# EAGLE design line-sensor-var1a-r3 (EAGLE 9.5.1)
Assembly variants: I2C, USART, SPI

## Sheet 1 of 5
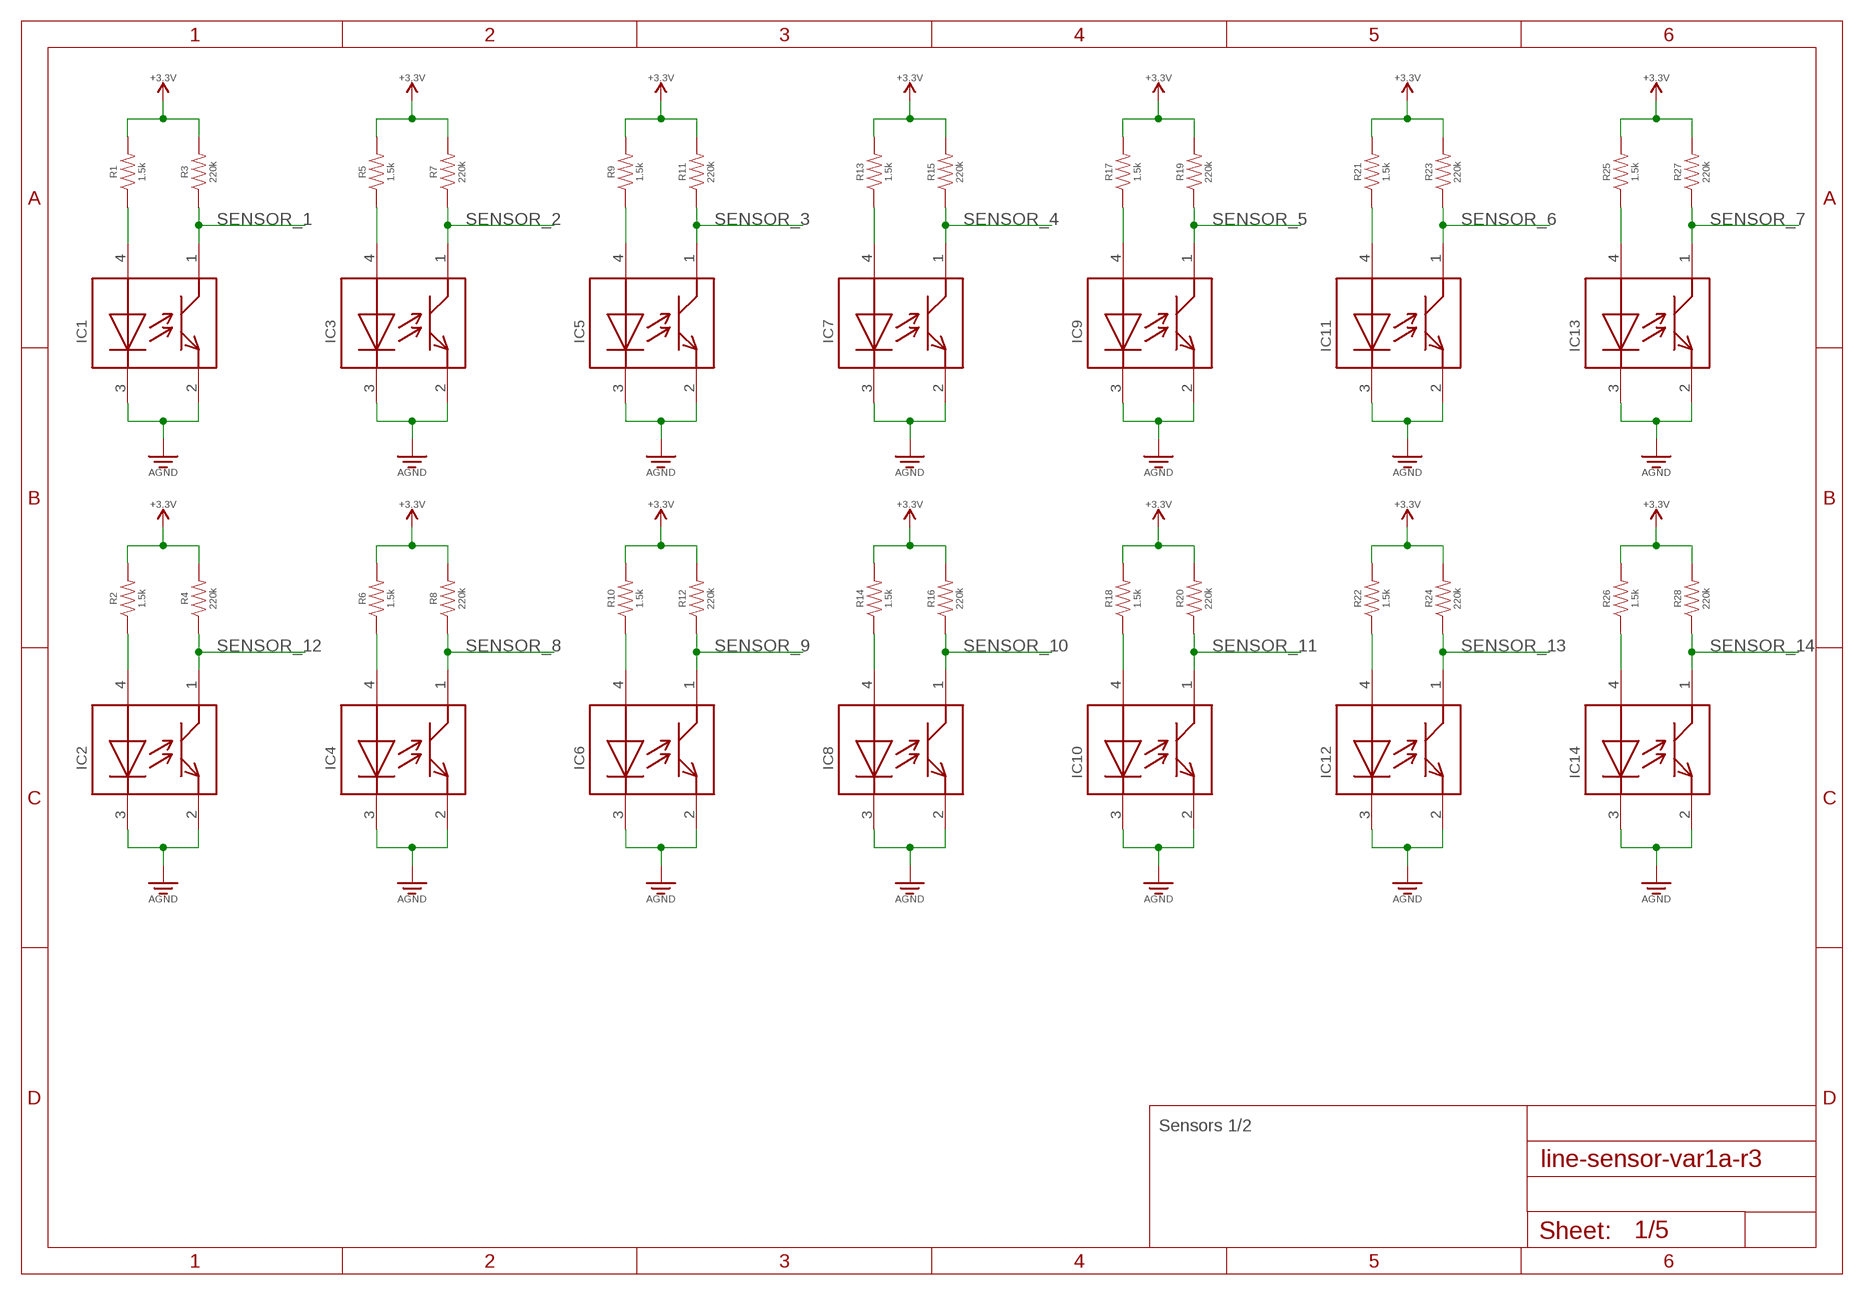
[diagram p0: schematic, sheet 1]

### Parts
IC1  GP2S60  [GP2S60]
IC2  GP2S60  [GP2S60]
IC3  GP2S60  [GP2S60]
IC4  GP2S60  [GP2S60]
IC5  GP2S60  [GP2S60]
IC6  GP2S60  [GP2S60]
IC7  GP2S60  [GP2S60]
IC8  GP2S60  [GP2S60]
IC9  GP2S60  [GP2S60]
IC10  GP2S60  [GP2S60]
IC11  GP2S60  [GP2S60]
IC12  GP2S60  [GP2S60]
IC13  GP2S60  [GP2S60]
IC14  GP2S60  [GP2S60]
R1  1.5k  RESISTOR0603  [RESISTOR-0603]
R2  1.5k  RESISTOR0603  [RESISTOR-0603]
R3  220k  RESISTOR0603  [RESISTOR-0603]
R4  220k  RESISTOR0603  [RESISTOR-0603]
R5  1.5k  RESISTOR0603  [RESISTOR-0603]
R6  1.5k  RESISTOR0603  [RESISTOR-0603]
R7  220k  RESISTOR0603  [RESISTOR-0603]
R8  220k  RESISTOR0603  [RESISTOR-0603]
R9  1.5k  RESISTOR0603  [RESISTOR-0603]
R10  1.5k  RESISTOR0603  [RESISTOR-0603]
R11  220k  RESISTOR0603  [RESISTOR-0603]
R12  220k  RESISTOR0603  [RESISTOR-0603]
R13  1.5k  RESISTOR0603  [RESISTOR-0603]
R14  1.5k  RESISTOR0603  [RESISTOR-0603]
R15  220k  RESISTOR0603  [RESISTOR-0603]
R16  220k  RESISTOR0603  [RESISTOR-0603]
R17  1.5k  RESISTOR0603  [RESISTOR-0603]
R18  1.5k  RESISTOR0603  [RESISTOR-0603]
R19  220k  RESISTOR0603  [RESISTOR-0603]
R20  220k  RESISTOR0603  [RESISTOR-0603]
R21  1.5k  RESISTOR0603  [RESISTOR-0603]
R22  1.5k  RESISTOR0603  [RESISTOR-0603]
R23  220k  RESISTOR0603  [RESISTOR-0603]
R24  220k  RESISTOR0603  [RESISTOR-0603]
R25  1.5k  RESISTOR0603  [RESISTOR-0603]
R26  1.5k  RESISTOR0603  [RESISTOR-0603]
R27  220k  RESISTOR0603  [RESISTOR-0603]
R28  220k  RESISTOR0603  [RESISTOR-0603]
SUPPLY1  +3.3V  (no package)
SUPPLY2  +3.3V  (no package)
SUPPLY3  +3.3V  (no package)
SUPPLY4  +3.3V  (no package)
SUPPLY5  +3.3V  (no package)
SUPPLY6  +3.3V  (no package)
SUPPLY7  +3.3V  (no package)
SUPPLY8  +3.3V  (no package)
SUPPLY9  +3.3V  (no package)
SUPPLY10  +3.3V  (no package)
SUPPLY11  +3.3V  (no package)
SUPPLY12  +3.3V  (no package)
SUPPLY13  +3.3V  (no package)
SUPPLY14  +3.3V  (no package)

### Nets
GND: IC1.2 IC1.3 IC2.2 IC2.3 IC3.2 IC3.3 IC4.2 IC4.3 IC5.2 IC5.3 IC6.2 IC6.3 IC7.2 IC7.3 IC8.2 IC8.3 IC9.2 IC9.3 IC10.2 IC10.3 IC11.2 IC11.3 IC12.2 IC12.3 IC13.2 IC13.3 IC14.2 IC14.3 ; supply symbol labelled AGND ; also sheet 2,3,4
N$1: IC3.4 R5.P$1
N$2: IC1.4 R1.P$1
N$3: IC5.4 R9.P$1
N$4: IC7.4 R13.P$1
N$5: IC9.4 R17.P$1
N$6: IC11.4 R21.P$1
N$7: IC13.4 R25.P$1
N$8: IC4.4 R6.P$1
N$9: IC6.4 R10.P$1
N$10: IC8.4 R14.P$1
N$11: IC10.4 R18.P$1
N$12: IC2.4 R2.P$1
N$13: IC12.4 R22.P$1
N$14: IC14.4 R26.P$1
SENSOR_1: IC1.1 R3.P$1 ; also sheet 3
SENSOR_2: IC3.1 R7.P$1 ; also sheet 3
SENSOR_3: IC5.1 R11.P$1 ; also sheet 3
SENSOR_4: IC7.1 R15.P$1 ; also sheet 3
SENSOR_5: IC9.1 R19.P$1 ; also sheet 3
SENSOR_6: IC11.1 R23.P$1 ; also sheet 3
SENSOR_7: IC13.1 R27.P$1 ; also sheet 3
SENSOR_8: IC4.1 R8.P$1 ; also sheet 3
SENSOR_9: IC6.1 R12.P$1 ; also sheet 3
SENSOR_10: IC8.1 R16.P$1 ; also sheet 3
SENSOR_11: IC10.1 R20.P$1 ; also sheet 3
SENSOR_12: IC2.1 R4.P$1 ; also sheet 3
SENSOR_13: IC12.1 R24.P$1 ; also sheet 3
SENSOR_14: IC14.1 R28.P$1 ; also sheet 3
VDD: R1.P$2 R2.P$2 R3.P$2 R4.P$2 R5.P$2 R6.P$2 R7.P$2 R8.P$2 R9.P$2 R10.P$2 R11.P$2 R12.P$2 R13.P$2 R14.P$2 R15.P$2 R16.P$2 R17.P$2 R18.P$2 R19.P$2 R20.P$2 R21.P$2 R22.P$2 R23.P$2 R24.P$2 R25.P$2 R26.P$2 R27.P$2 R28.P$2 SUPPLY1.VCC SUPPLY2.VCC SUPPLY3.VCC SUPPLY4.VCC SUPPLY5.VCC SUPPLY6.VCC SUPPLY7.VCC SUPPLY8.VCC SUPPLY9.VCC SUPPLY10.VCC SUPPLY11.VCC SUPPLY12.VCC SUPPLY13.VCC SUPPLY14.VCC ; also sheet 2,4

### Notes on the sheet
- Sensors 1/2

## Sheet 2 of 5
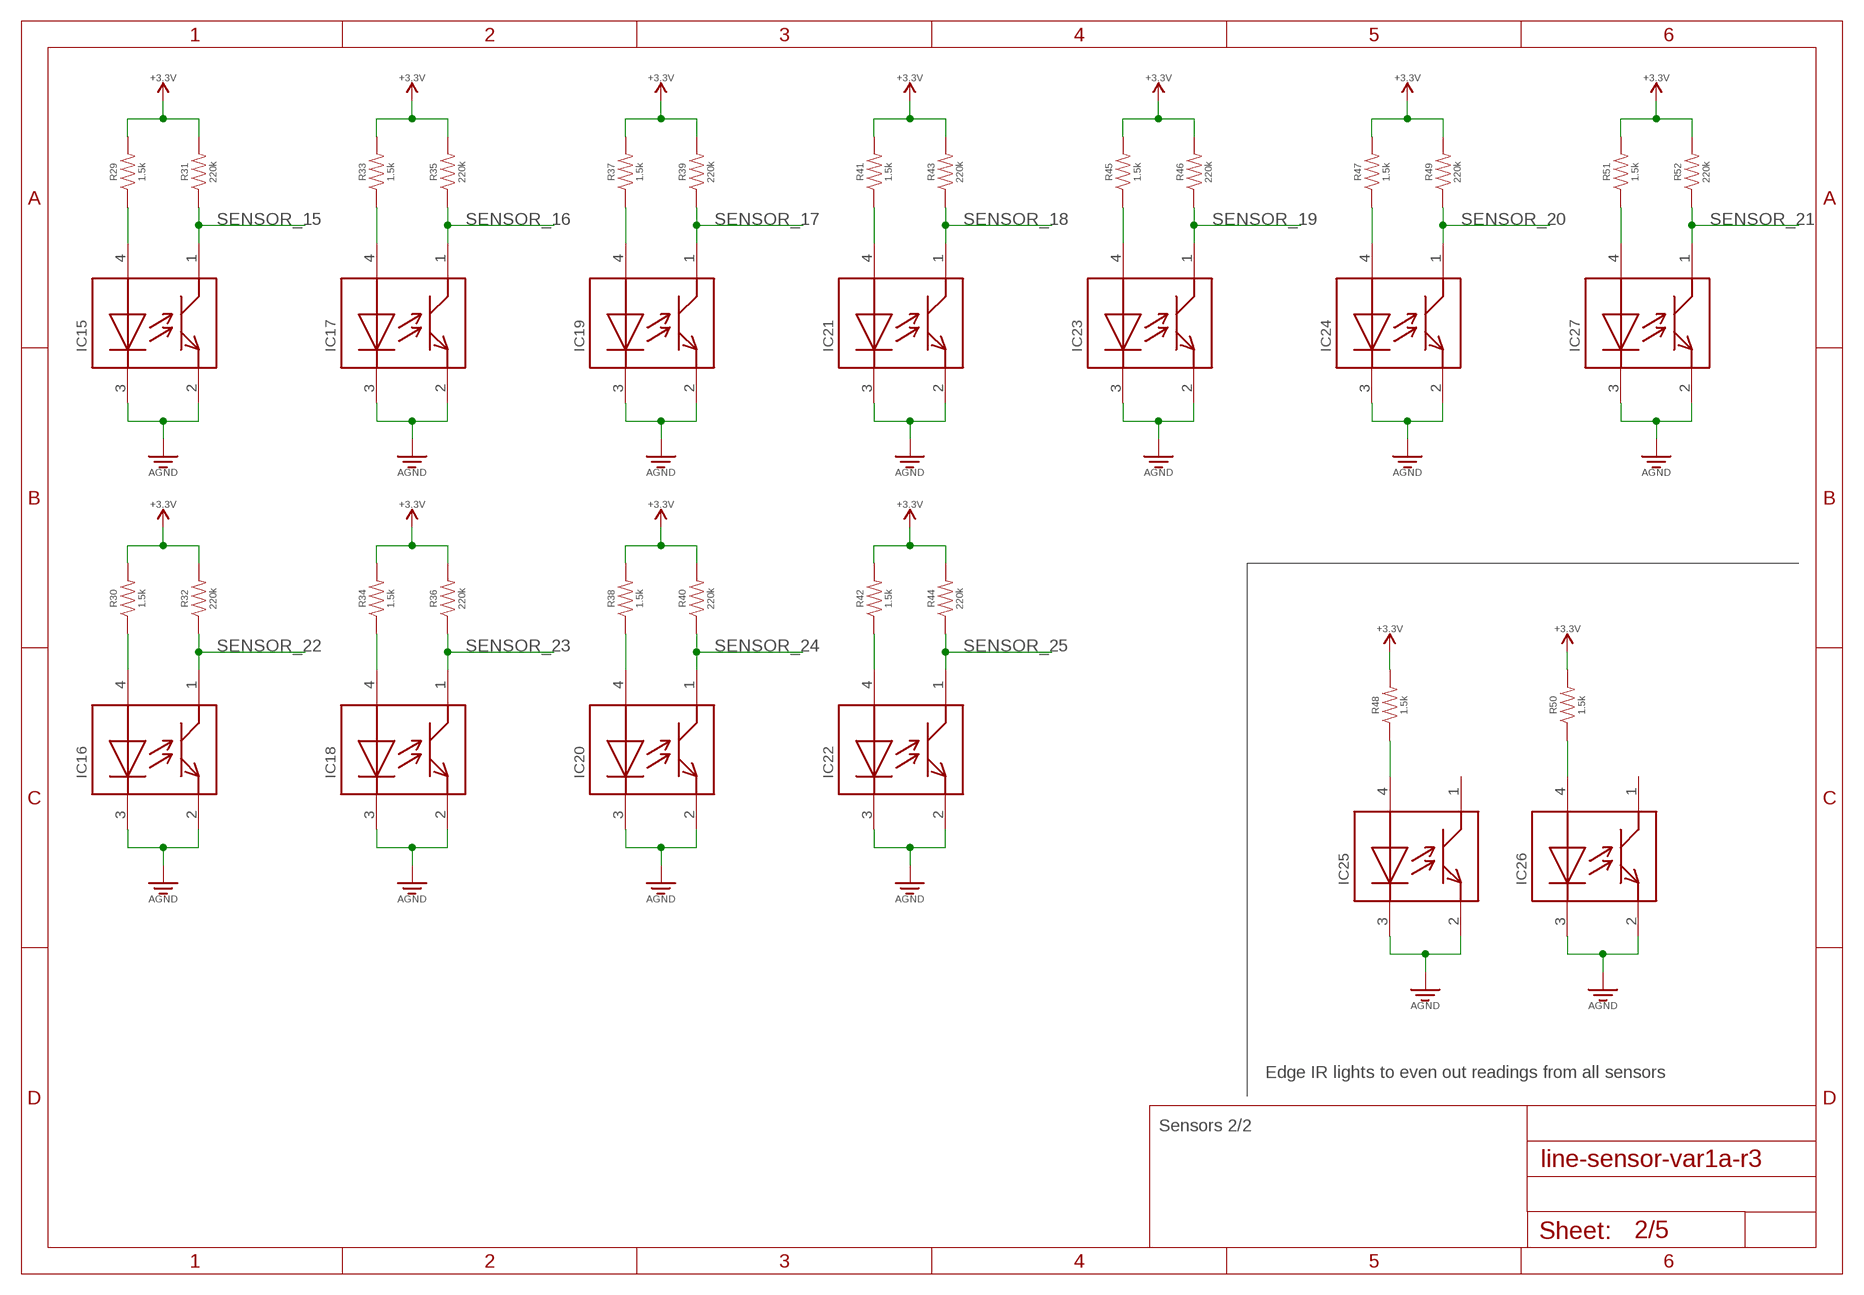
[diagram p1: schematic, sheet 2]

### Parts
IC15  GP2S60  [GP2S60]
IC16  GP2S60  [GP2S60]
IC17  GP2S60  [GP2S60]
IC18  GP2S60  [GP2S60]
IC19  GP2S60  [GP2S60]
IC20  GP2S60  [GP2S60]
IC21  GP2S60  [GP2S60]
IC22  GP2S60  [GP2S60]
IC23  GP2S60  [GP2S60]
IC24  GP2S60  [GP2S60]
IC25  GP2S60  [GP2S60]
IC26  GP2S60  [GP2S60]
IC27  GP2S60  [GP2S60]
R29  1.5k  RESISTOR0603  [RESISTOR-0603]
R30  1.5k  RESISTOR0603  [RESISTOR-0603]
R31  220k  RESISTOR0603  [RESISTOR-0603]
R32  220k  RESISTOR0603  [RESISTOR-0603]
R33  1.5k  RESISTOR0603  [RESISTOR-0603]
R34  1.5k  RESISTOR0603  [RESISTOR-0603]
R35  220k  RESISTOR0603  [RESISTOR-0603]
R36  220k  RESISTOR0603  [RESISTOR-0603]
R37  1.5k  RESISTOR0603  [RESISTOR-0603]
R38  1.5k  RESISTOR0603  [RESISTOR-0603]
R39  220k  RESISTOR0603  [RESISTOR-0603]
R40  220k  RESISTOR0603  [RESISTOR-0603]
R41  1.5k  RESISTOR0603  [RESISTOR-0603]
R42  1.5k  RESISTOR0603  [RESISTOR-0603]
R43  220k  RESISTOR0603  [RESISTOR-0603]
R44  220k  RESISTOR0603  [RESISTOR-0603]
R45  1.5k  RESISTOR0603  [RESISTOR-0603]
R46  220k  RESISTOR0603  [RESISTOR-0603]
R47  1.5k  RESISTOR0603  [RESISTOR-0603]
R48  1.5k  RESISTOR0603  [RESISTOR-0603]
R49  220k  RESISTOR0603  [RESISTOR-0603]
R50  1.5k  RESISTOR0603  [RESISTOR-0603]
R51  1.5k  RESISTOR0603  [RESISTOR-0603]
R52  220k  RESISTOR0603  [RESISTOR-0603]
SUPPLY15  +3.3V  (no package)
SUPPLY16  +3.3V  (no package)
SUPPLY17  +3.3V  (no package)
SUPPLY18  +3.3V  (no package)
SUPPLY19  +3.3V  (no package)
SUPPLY20  +3.3V  (no package)
SUPPLY21  +3.3V  (no package)
SUPPLY22  +3.3V  (no package)
SUPPLY23  +3.3V  (no package)
SUPPLY24  +3.3V  (no package)
SUPPLY25  +3.3V  (no package)
SUPPLY26  +3.3V  (no package)
SUPPLY27  +3.3V  (no package)

### Nets
GND: IC15.2 IC15.3 IC16.2 IC16.3 IC17.2 IC17.3 IC18.2 IC18.3 IC19.2 IC19.3 IC20.2 IC20.3 IC21.2 IC21.3 IC22.2 IC22.3 IC23.2 IC23.3 IC24.2 IC24.3 IC25.2 IC25.3 IC26.2 IC26.3 IC27.2 IC27.3 ; supply symbol labelled AGND ; also sheet 1,3,4
N$15: IC15.4 R29.P$1
N$16: IC17.4 R33.P$1
N$17: IC19.4 R37.P$1
N$18: IC21.4 R41.P$1
N$19: IC23.4 R45.P$1
N$20: IC24.4 R47.P$1
N$21: IC27.4 R51.P$1
N$22: IC16.4 R30.P$1
N$23: IC18.4 R34.P$1
N$24: IC20.4 R38.P$1
N$25: IC22.4 R42.P$1
N$30: IC26.4 R50.P$1
N$31: IC25.4 R48.P$1
SENSOR_15: IC15.1 R31.P$1 ; also sheet 3
SENSOR_16: IC17.1 R35.P$1 ; also sheet 3
SENSOR_17: IC19.1 R39.P$1 ; also sheet 3
SENSOR_18: IC21.1 R43.P$1 ; also sheet 3
SENSOR_19: IC23.1 R46.P$1 ; also sheet 3
SENSOR_20: IC24.1 R49.P$1 ; also sheet 3
SENSOR_21: IC27.1 R52.P$1 ; also sheet 3
SENSOR_22: IC16.1 R32.P$1 ; also sheet 3
SENSOR_23: IC18.1 R36.P$1 ; also sheet 3
SENSOR_24: IC20.1 R40.P$1 ; also sheet 3
SENSOR_25: IC22.1 R44.P$1 ; also sheet 3
VDD: R29.P$2 R30.P$2 R31.P$2 R32.P$2 R33.P$2 R34.P$2 R35.P$2 R36.P$2 R37.P$2 R38.P$2 R39.P$2 R40.P$2 R41.P$2 R42.P$2 R43.P$2 R44.P$2 R45.P$2 R46.P$2 R47.P$2 R48.P$2 R49.P$2 R50.P$2 R51.P$2 R52.P$2 SUPPLY15.VCC SUPPLY16.VCC SUPPLY17.VCC SUPPLY18.VCC SUPPLY19.VCC SUPPLY20.VCC SUPPLY21.VCC SUPPLY22.VCC SUPPLY23.VCC SUPPLY24.VCC SUPPLY25.VCC SUPPLY26.VCC SUPPLY27.VCC ; also sheet 1,4
Unconnected: IC25.1 IC26.1

### Notes on the sheet
- Edge IR lights to even out readings from all sensors
- Sensors 2/2

## Sheet 3 of 5
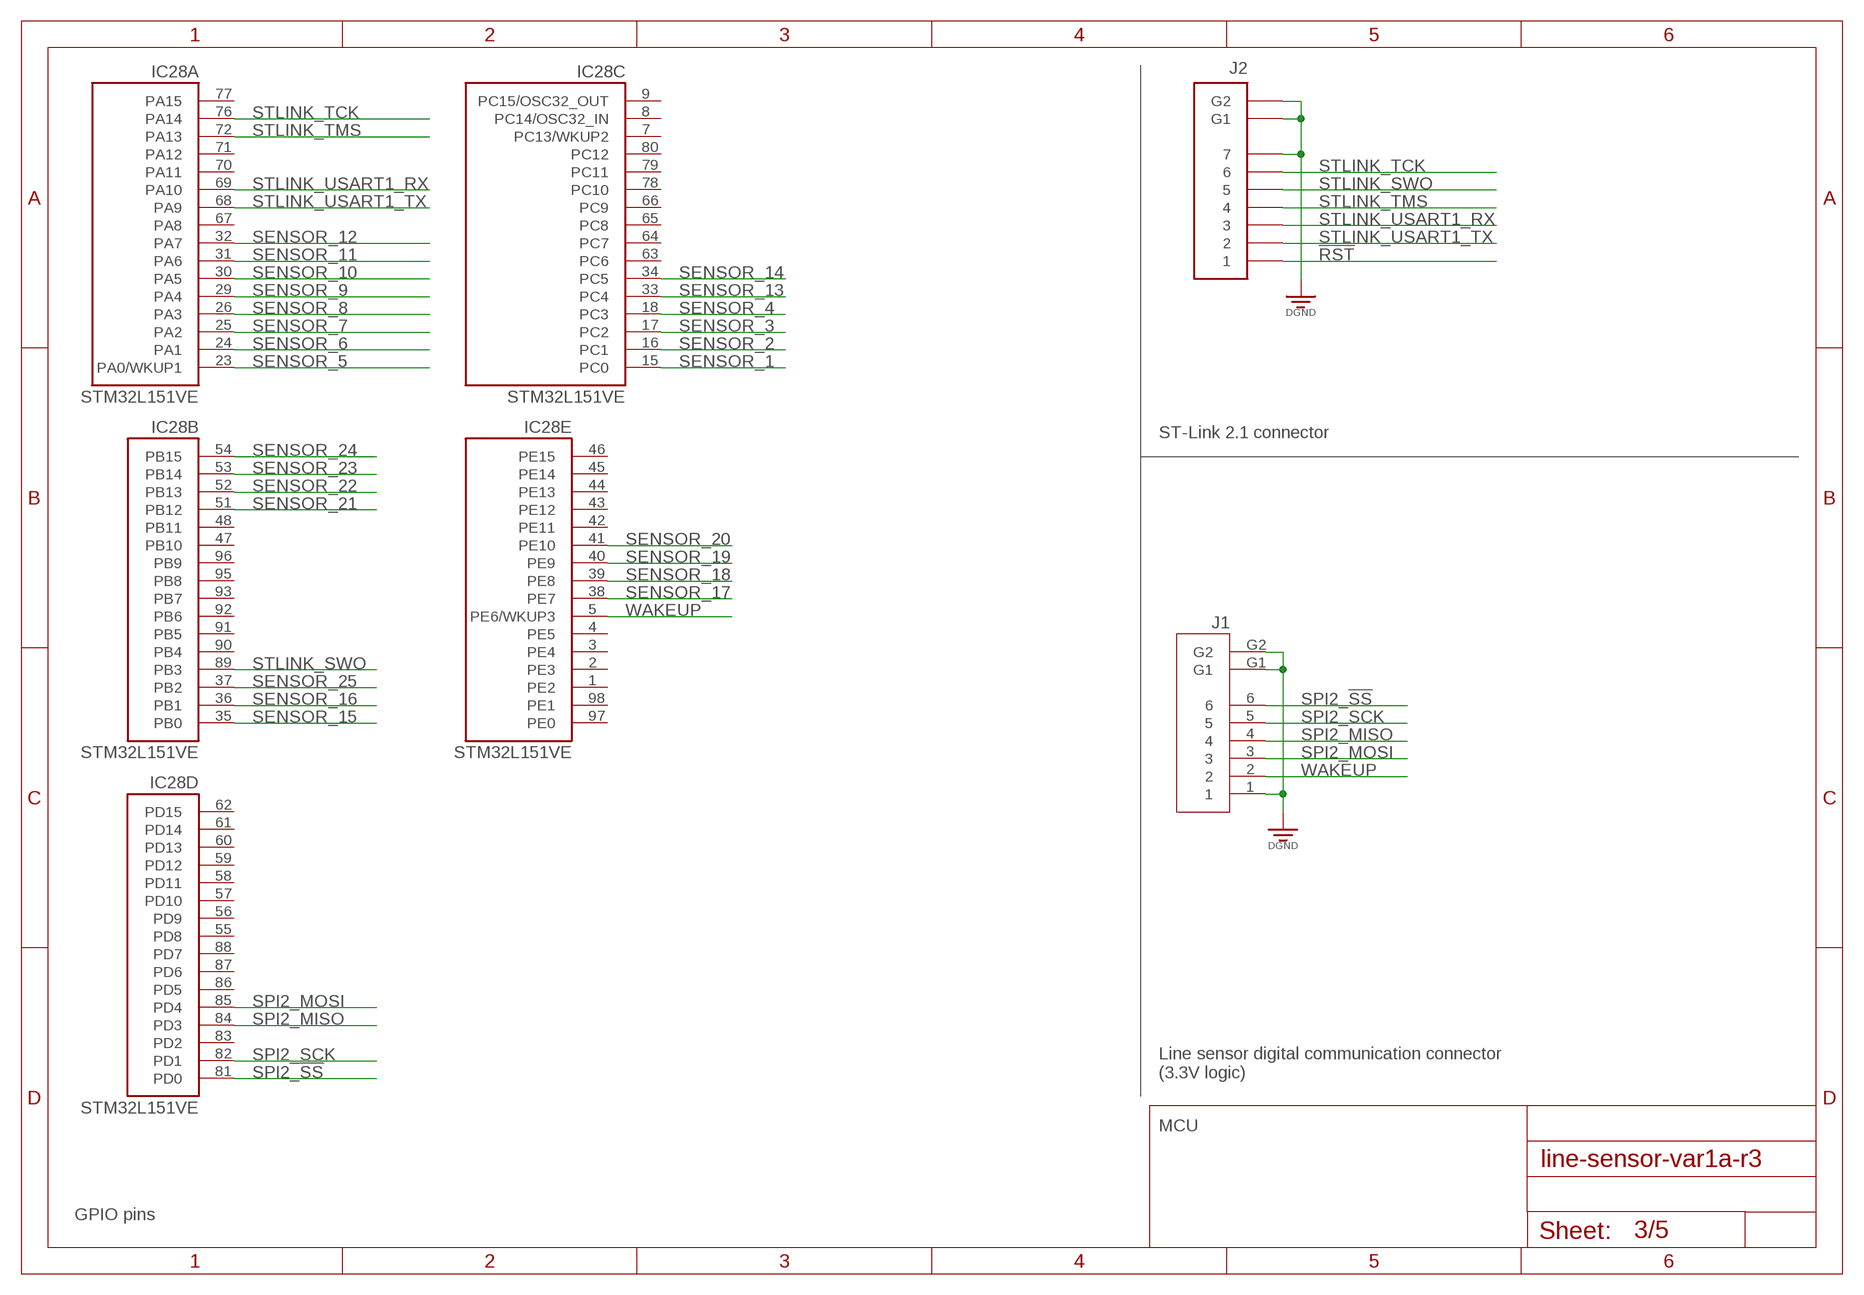
[diagram p2: schematic, sheet 3]

### Parts
IC28  STM32L151VE  [LQFP100_14X14]
J1  MOLEX-502382-06XX  [MOLEX-502382-06XX]
J2  MOLEX-53261-0771  [MOLEX-53261-0771]

### Nets
!RST: J2.1 ; also sheet 4
GND: J1.1 J1.G1 J1.G2 J2.7 J2.G1 J2.G2 ; supply symbol labelled DGND ; also sheet 1,2,4
SENSOR_1: IC28.15(C:PC0) ; also sheet 1
SENSOR_2: IC28.16(C:PC1) ; also sheet 1
SENSOR_3: IC28.17(C:PC2) ; also sheet 1
SENSOR_4: IC28.18(C:PC3) ; also sheet 1
SENSOR_5: IC28.23(A:PA0/WKUP1) ; also sheet 1
SENSOR_6: IC28.24(A:PA1) ; also sheet 1
SENSOR_7: IC28.25(A:PA2) ; also sheet 1
SENSOR_8: IC28.26(A:PA3) ; also sheet 1
SENSOR_9: IC28.29(A:PA4) ; also sheet 1
SENSOR_10: IC28.30(A:PA5) ; also sheet 1
SENSOR_11: IC28.31(A:PA6) ; also sheet 1
SENSOR_12: IC28.32(A:PA7) ; also sheet 1
SENSOR_13: IC28.33(C:PC4) ; also sheet 1
SENSOR_14: IC28.34(C:PC5) ; also sheet 1
SENSOR_15: IC28.35(B:PB0) ; also sheet 2
SENSOR_16: IC28.36(B:PB1) ; also sheet 2
SENSOR_17: IC28.38(E:PE7) ; also sheet 2
SENSOR_18: IC28.39(E:PE8) ; also sheet 2
SENSOR_19: IC28.40(E:PE9) ; also sheet 2
SENSOR_20: IC28.41(E:PE10) ; also sheet 2
SENSOR_21: IC28.51(B:PB12) ; also sheet 2
SENSOR_22: IC28.52(B:PB13) ; also sheet 2
SENSOR_23: IC28.53(B:PB14) ; also sheet 2
SENSOR_24: IC28.54(B:PB15) ; also sheet 2
SENSOR_25: IC28.37(B:PB2) ; also sheet 2
SPI2_!SS: IC28.81(D:PD0) J1.6
SPI2_MISO: IC28.84(D:PD3) J1.4
SPI2_MOSI: IC28.85(D:PD4) J1.3
SPI2_SCK: IC28.82(D:PD1) J1.5
STLINK_SWO: IC28.89(B:PB3) J2.5
STLINK_TCK: IC28.76(A:PA14) J2.6
STLINK_TMS: IC28.72(A:PA13) J2.4
STLINK_USART1_RX: IC28.69(A:PA10) J2.3
STLINK_USART1_TX: IC28.68(A:PA9) J2.2
WAKEUP: IC28.5(E:PE6/WKUP3) J1.2
Unconnected: IC28.1(E:PE2) IC28.2(E:PE3) IC28.3(E:PE4) IC28.4(E:PE5) IC28.7(C:PC13/WKUP2) IC28.8(C:PC14/OSC32_IN) IC28.9(C:PC15/OSC32_OUT) IC28.42(E:PE11) IC28.43(E:PE12) IC28.44(E:PE13) IC28.45(E:PE14) IC28.46(E:PE15) IC28.47(B:PB10) IC28.48(B:PB11) IC28.55(D:PD8) IC28.56(D:PD9) IC28.57(D:PD10) IC28.58(D:PD11) IC28.59(D:PD12) IC28.60(D:PD13) IC28.61(D:PD14) IC28.62(D:PD15) IC28.63(C:PC6) IC28.64(C:PC7) IC28.65(C:PC8) IC28.66(C:PC9) IC28.67(A:PA8) IC28.70(A:PA11) IC28.71(A:PA12) IC28.77(A:PA15) IC28.78(C:PC10) IC28.79(C:PC11) IC28.80(C:PC12) IC28.83(D:PD2) IC28.86(D:PD5) IC28.87(D:PD6) IC28.88(D:PD7) IC28.90(B:PB4) IC28.91(B:PB5) IC28.92(B:PB6) IC28.93(B:PB7) IC28.95(B:PB8) IC28.96(B:PB9) IC28.97(E:PE0) IC28.98(E:PE1)

### Notes on the sheet
- ST-Link 2.1 connector
- Line sensor digital communication connector
  (3.3V logic)
- MCU
- GPIO pins

## Sheet 4 of 5
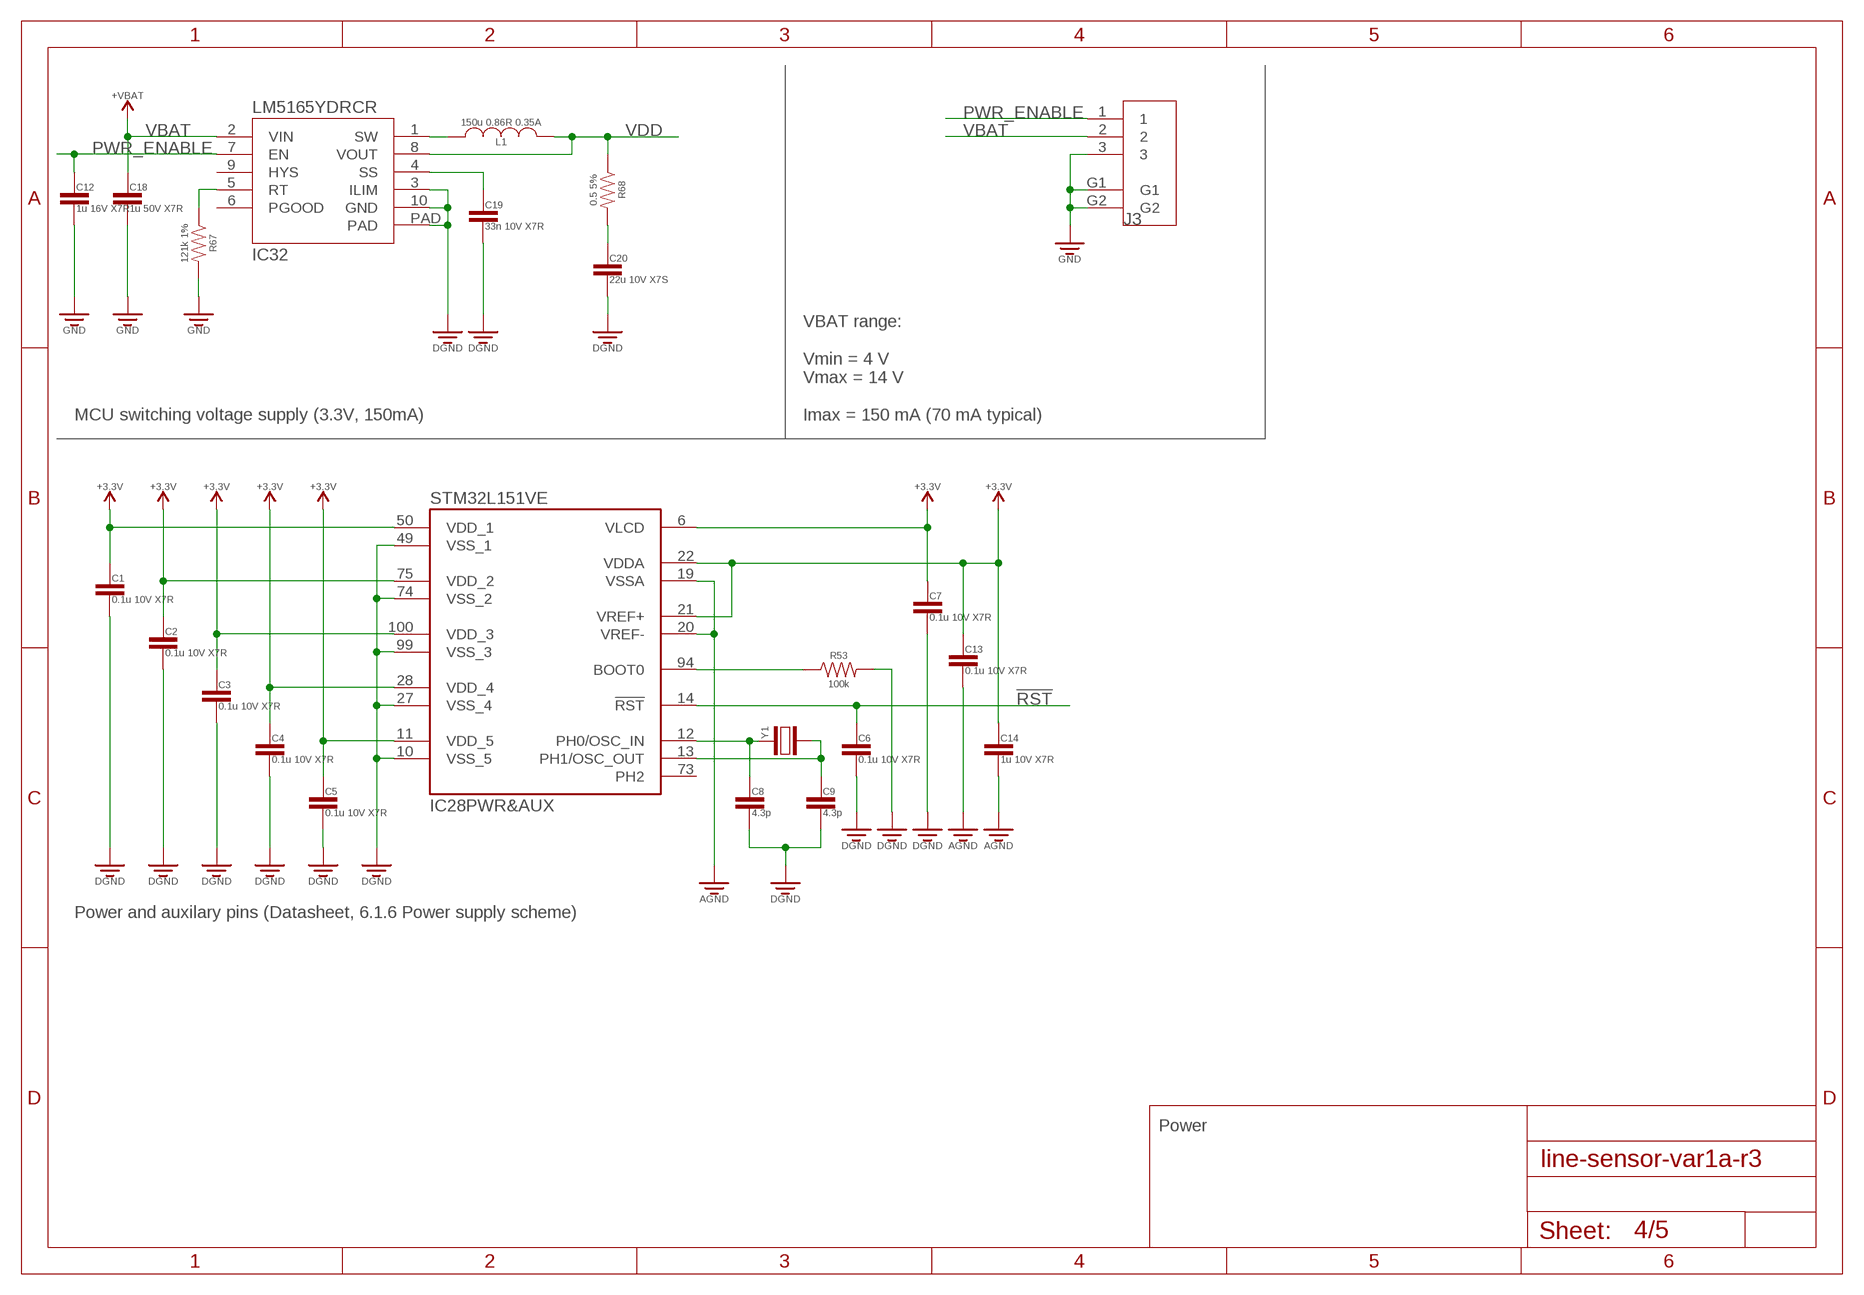
[diagram p3: schematic, sheet 4]

### Parts
C1  0.1u 10V X7R  CAPACITOR0402  [CAPACITOR-0402]
C2  0.1u 10V X7R  CAPACITOR0402  [CAPACITOR-0402]
C3  0.1u 10V X7R  CAPACITOR0402  [CAPACITOR-0402]
C4  0.1u 10V X7R  CAPACITOR0402  [CAPACITOR-0402]
C5  0.1u 10V X7R  CAPACITOR0402  [CAPACITOR-0402]
C6  0.1u 10V X7R  CAPACITOR0402  [CAPACITOR-0402]
C7  0.1u 10V X7R  CAPACITOR0402  [CAPACITOR-0402]
C8  4.3p  CAPACITOR0603  [CAPACITOR-0603]
C9  4.3p  CAPACITOR0603  [CAPACITOR-0603]
C12  1u 16V X7R  CAPACITOR0603  [CAPACITOR-0603]
C13  0.1u 10V X7R  CAPACITOR0402  [CAPACITOR-0402]
C14  1u 10V X7R  CAPACITOR0402  [CAPACITOR-0402]
C18  1u 50V X7R  CAPACITOR1206  [CAPACITOR-1206]
C19  33n 10V X7R  CAPACITOR0603  [CAPACITOR-0603]
C20  22u 10V X7S  CAPACITOR0805  [CAPACITOR-0805]
IC32  LM5165YDRCR  [VSON-10-0.5MM]
J3  MOLEX-502382-03XX  [MOLEX-502382-03XX]
L1  150u 0.86R 0.35A  INDUCTORPANASONIC-SERIES-H  [PANASONIC-SERIES-H]
R53  100k  RESISTOR0603  [RESISTOR-0603]
R67  121k 1%  RESISTOR0603  [RESISTOR-0603]
R68  0.5 5%  RESISTOR0603  [RESISTOR-0603]
SUPPLY28  +3.3V  (no package)
SUPPLY29  +3.3V  (no package)
SUPPLY30  +3.3V  (no package)
SUPPLY31  +3.3V  (no package)
SUPPLY32  +3.3V  (no package)
SUPPLY33  +3.3V  (no package)
SUPPLY35  +VBAT  (no package)
SUPPLY37  +3.3V  (no package)
Y1  CRYSTALKYOCERA-CX5032GA  [KYOCERA-CX5032GA]

### Nets
!RST: C6.P$1 IC28.14(PWR&AUX:!RST!) ; also sheet 3
BOOT0: IC28.94(PWR&AUX:BOOT0) R53.P$1
GND: C1.P$2 C2.P$2 C3.P$2 C4.P$2 C5.P$2 C6.P$2 C7.P$2 C8.2 C9.2 C12.2 C13.P$2 C14.P$2 C18.P$2 C19.2 C20.2 IC28.10(PWR&AUX:VSS_5) IC28.19(PWR&AUX:VSSA) IC28.20(PWR&AUX:VREF-) IC28.27(PWR&AUX:VSS_4) IC28.49(PWR&AUX:VSS_1) IC28.74(PWR&AUX:VSS_2) IC28.99(PWR&AUX:VSS_3) IC32.3(ILIM) IC32.10(GND) IC32.PAD J3.3 J3.G1 J3.G2 R53.P$2 R67.P$2 ; supply symbol labelled DGND, AGND ; also sheet 1,2,3
IC32_SW: IC32.1(SW) L1.1
N$33: C8.1 IC28.12(PWR&AUX:PH0/OSC_IN) Y1.P$1
N$34: C9.1 IC28.13(PWR&AUX:PH1/OSC_OUT) Y1.P$2
N$35: IC32.5(RT) R67.P$1
N$40: C19.1 IC32.4(SS)
N$42: C20.1 R68.P$2
PWR_ENABLE: C12.1 IC32.7(EN) J3.1
VBAT: C18.P$1 IC32.2(VIN) J3.2 SUPPLY35.VCC
VDD: C1.P$1 C2.P$1 C3.P$1 C4.P$1 C5.P$1 C7.P$1 C13.P$1 C14.P$1 IC28.6(PWR&AUX:VLCD) IC28.11(PWR&AUX:VDD_5) IC28.21(PWR&AUX:VREF+) IC28.22(PWR&AUX:VDDA) IC28.28(PWR&AUX:VDD_4) IC28.50(PWR&AUX:VDD_1) IC28.75(PWR&AUX:VDD_2) IC28.100(PWR&AUX:VDD_3) IC32.8(VOUT) L1.2 R68.P$1 SUPPLY28.VCC SUPPLY29.VCC SUPPLY30.VCC SUPPLY31.VCC SUPPLY32.VCC SUPPLY33.VCC SUPPLY37.VCC ; also sheet 1,2
Unconnected: IC28.73(PWR&AUX:PH2) IC32.6(PGOOD) IC32.9(HYS)

### Notes on the sheet
- MCU switching voltage supply (3.3V, 150mA)
- VBAT range:
  
  Vmin = 4 V
  Vmax = 14 V
  
  Imax = 150 mA (70 mA typical)
- Power and auxilary pins (Datasheet, 6.1.6 Power supply scheme)
- Power

## Sheet 5 of 5
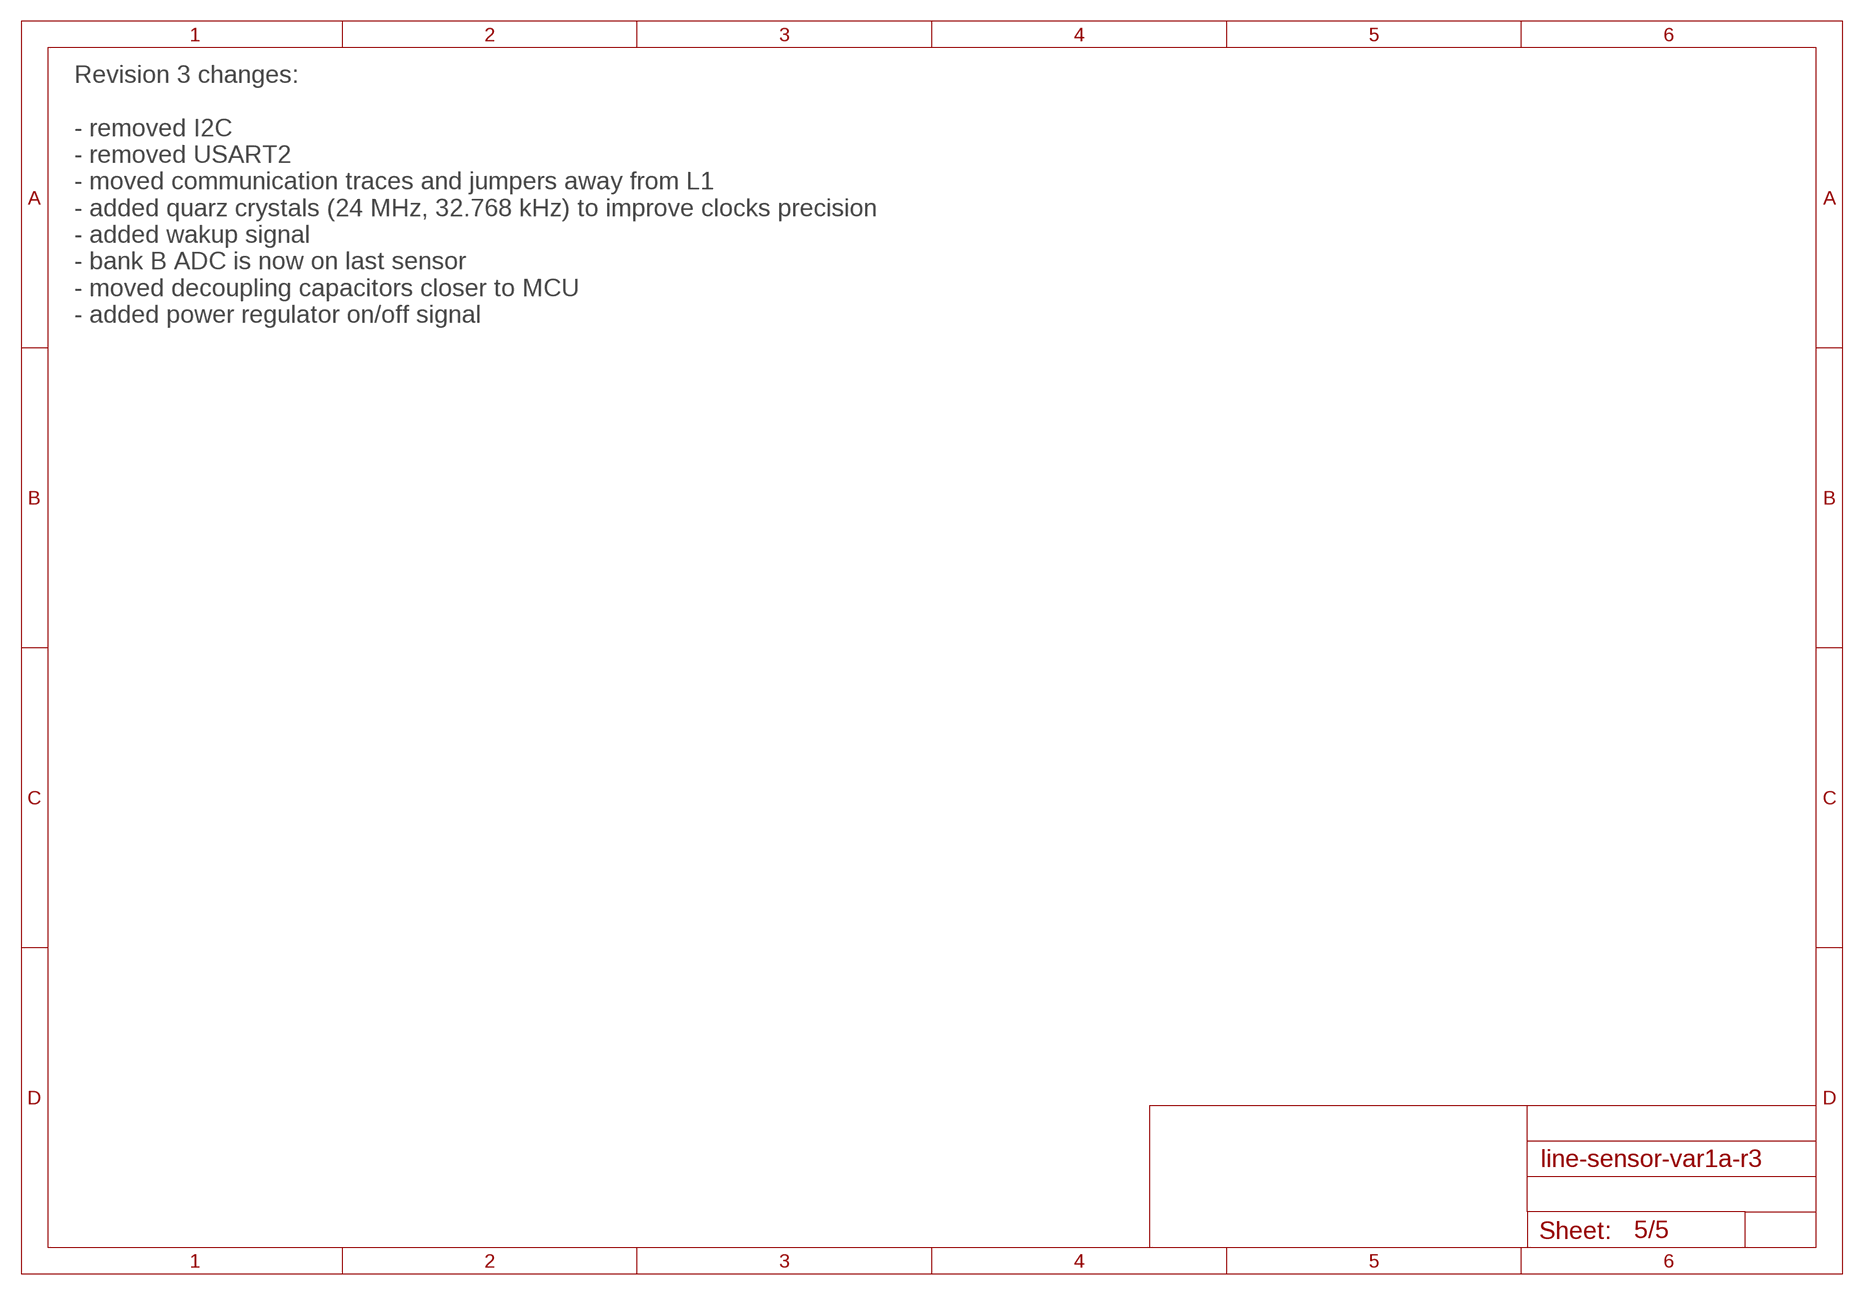
[diagram p4: schematic, sheet 5]

### Notes on the sheet
- Revision 3 changes:
  
  - removed I2C
  - removed USART2
  - moved communication traces and jumpers away from L1
  - added quarz crystals (24 MHz, 32.768 kHz) to improve clocks precision
  - added wakup signal
  - bank B ADC is now on last sensor
  - moved decoupling capacitors closer to MCU
  - added power regulator on/off signal

## Library data of the parts
C1-C9 C12-C14 C18-C20 = passives:CAPACITOR
IC1-IC27 = sensors:GP2S60: SMT Compact Reﬂective Photointerrupter Datasheet: http://www.sharp-world.com/products/device/lineup/data/pdf/datasheet/gp2s60_e.pdf
IC28 = mcu:STM32L151VE
IC32 = voltage-regulator:LM5165YDRCR: Texas Instruments V in: 3...65 V V out: 3.3 V I out: 150 mA Frequency: <= 600kHz
J1 = connectors:MOLEX-502382-06XX
J2 = connectors:MOLEX-53261-0771
J3 = connectors:MOLEX-502382-03XX
L1 = passives:INDUCTOR
R1-R53 R67 R68 = passives:RESISTOR
SUPPLY1-SUPPLY33 SUPPLY37 = voltage-ground:+3.3V: +3.3V Voltage Supply Positive voltage supply (traditionally for a BJT device, C=collector).
SUPPLY35 = voltage-ground:+VBAT: +3.3V Voltage Supply Positive voltage supply (traditionally for a BJT device, C=collector).
Y1 = passives:CRYSTAL

## Net classes
1 ground: width 0.3 mm
2 3v3: width 0.3 mm

## Board
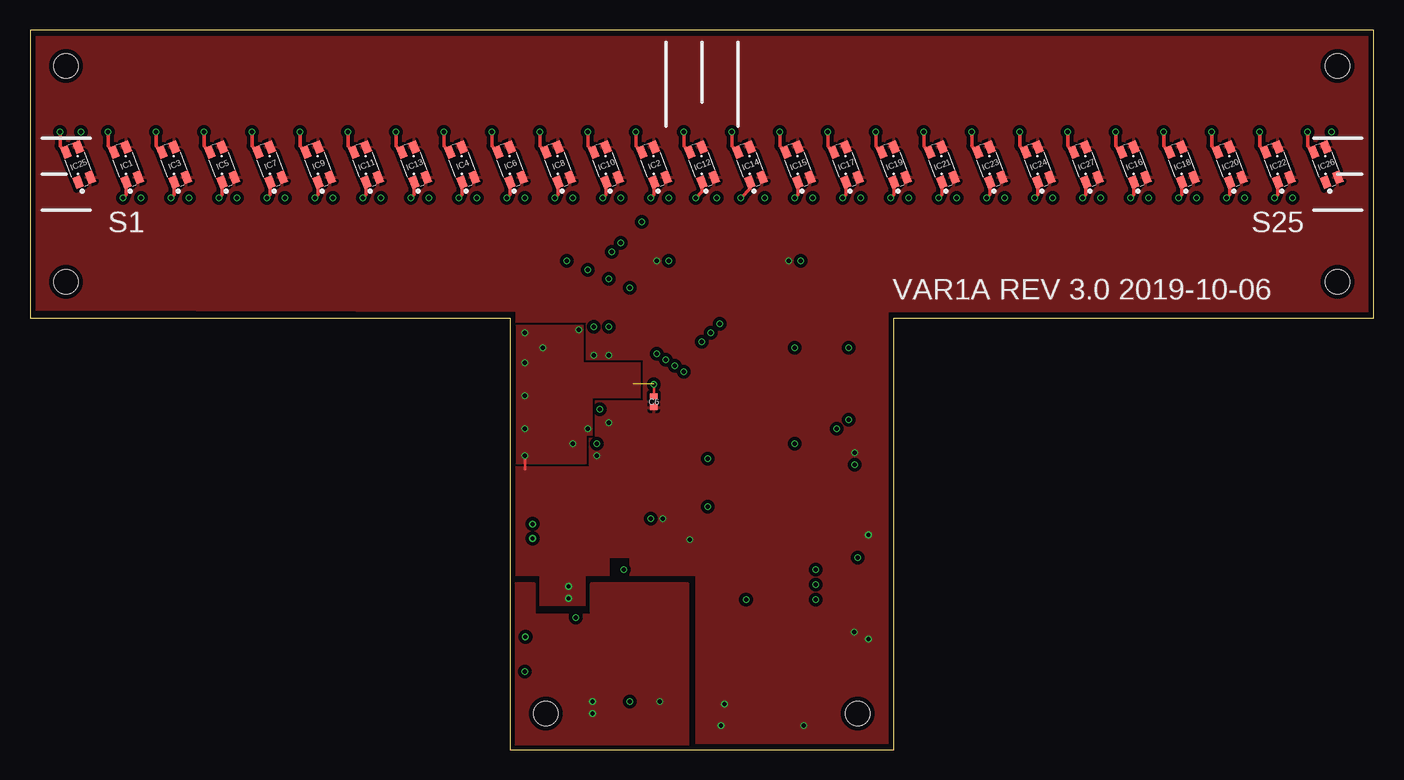
[diagram p5: board, top side]
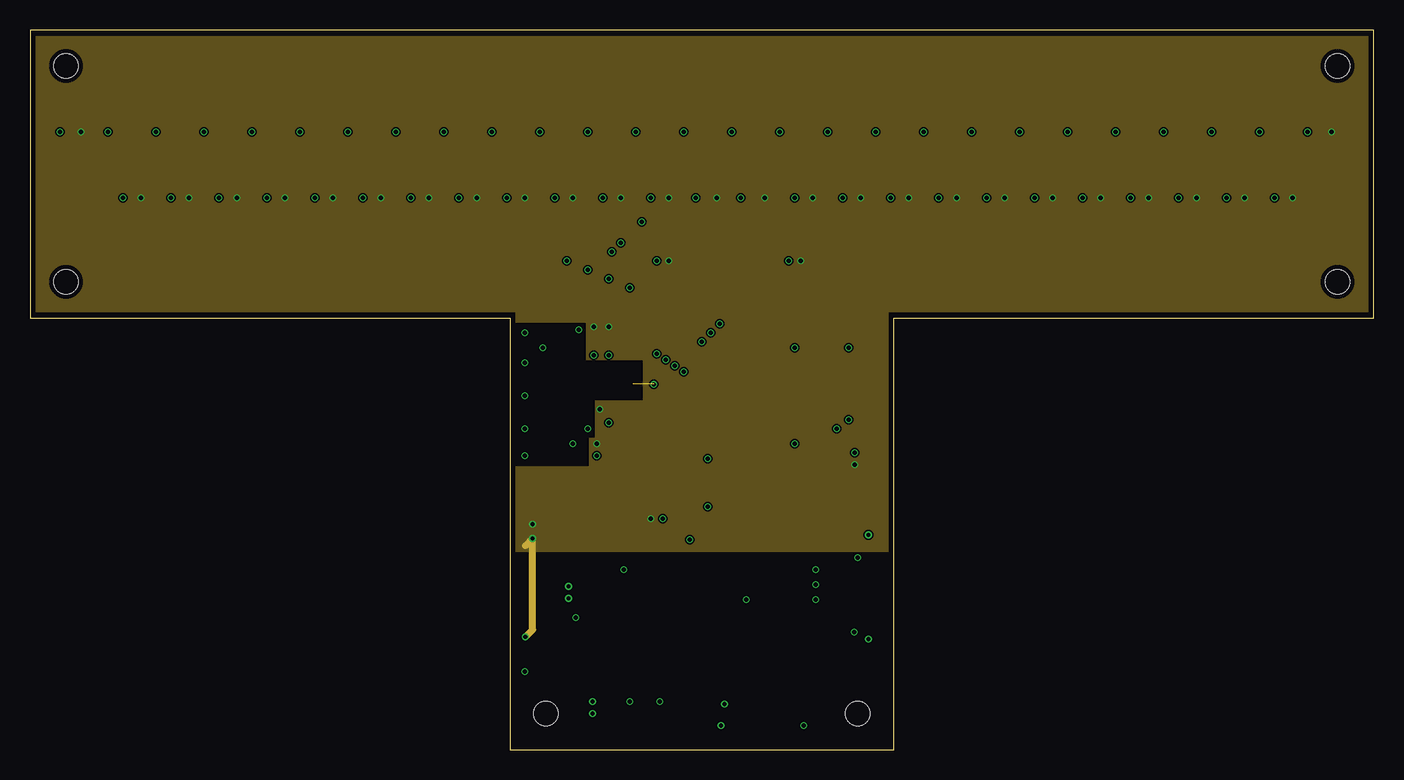
[diagram p6: board, inner layer Route2]
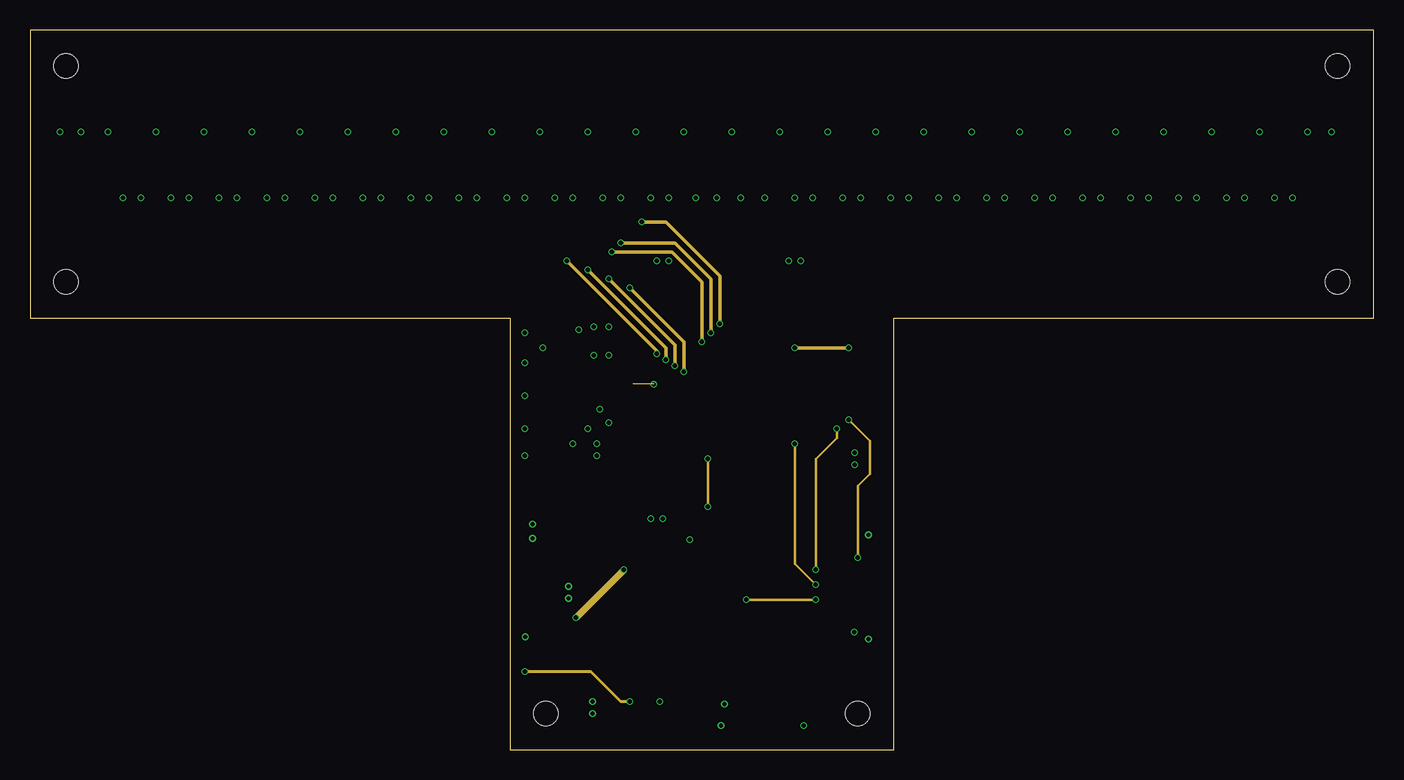
[diagram p7: board, inner layer Route15]
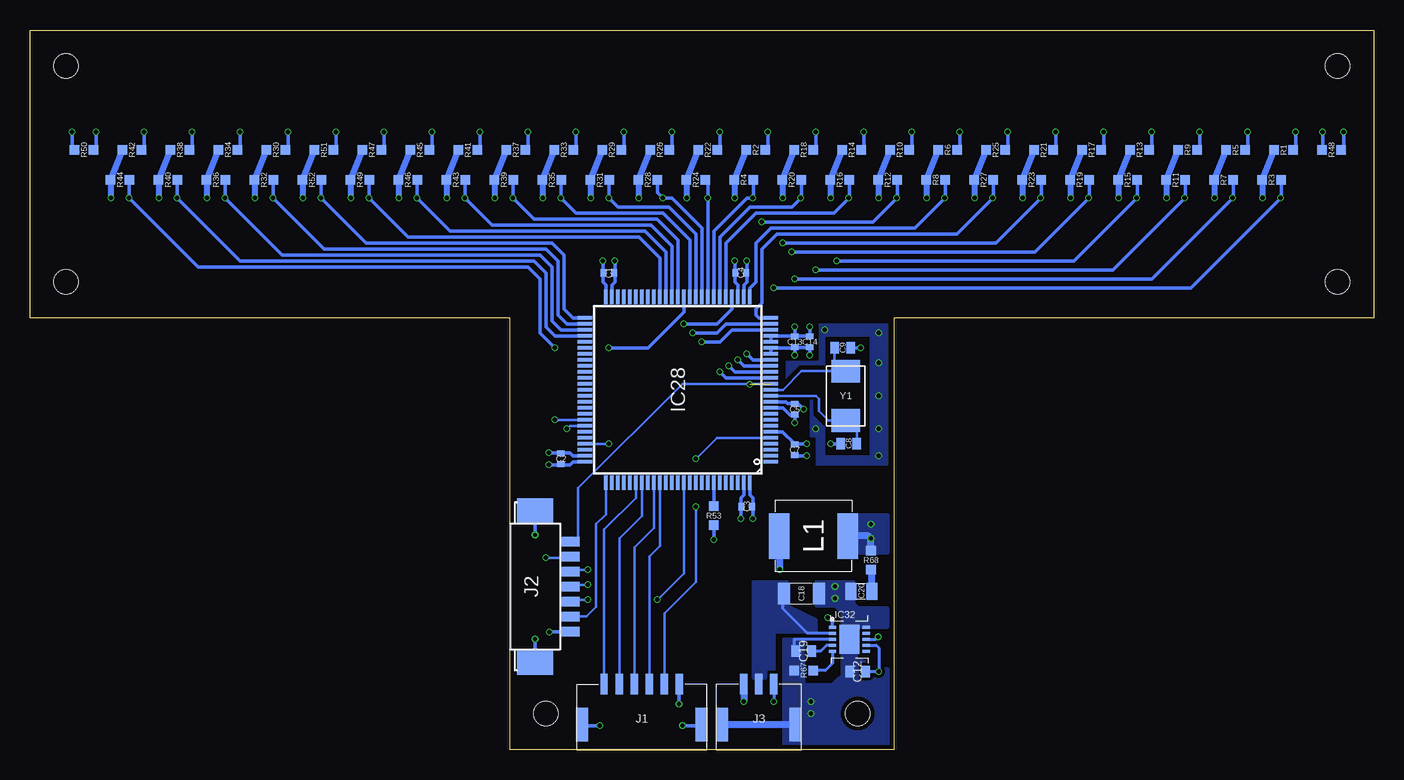
[diagram p8: board, bottom side, seen from below]

Size 112 x 60 mm. Coordinates in mm from the lower left corner, seen from the top.
Outline: 0,36 40,36 40,0 72,0 72,36 112,36 112,60 0,60 0,36
Copper layers (1*2*15*16): Top 0.035559375mm / dielectric 0.17018125mm / Route2 0.01778125mm / dielectric 47mil / Route15 0.01778125mm / dielectric 0.17018125mm / Bottom 0.035559375mm
Design rules "oshpark-4layer": minimum track width 5mil, minimum drill 10mil, track to track 5mil, track to pad 5mil, pad to pad 5mil, via to via 5mil, smd to smd 5mil, copper to edge 15mil, drill to drill 6mil, minimum pad ring 4mil, minimum via ring 4mil, stop-mask expansion 2.5mil, vias tented up to drill 0mil, thermal gap 10mil
Holes 2 mm at 3,57 3,39 109,57 109,39 43,3 69,3

### Footprints (pad centres in the part's own frame; a part is rotated, then mirrored left to right if it is on the bottom)
CAPACITOR-0402 = smd 0.47 x 0.6: P$1 -0.46,0; P$2 0.46,0
CAPACITOR-0603 = smd 0.7 x 0.95: 1 -0.675,0; 2 0.675,0
CAPACITOR-1206 = smd 1 x 1.8: P$1 -1.45,0; P$2 1.45,0
CAPACITOR-0805 = smd 0.9 x 1.4: 1 -0.875,0; 2 0.875,0
GP2S60 = smd 1 x 0.65: 1 -0.65,0.25; 2 -0.65,-0.85; 3 2.05,-0.85; 4 2.05,0.25
LQFP100_14X14 = smd 0.3 x 1.2: 1 -6,-7.75; 2 -5.5,-7.75; 3 -5,-7.75; 4 -4.5,-7.75; 5 -4,-7.75; 6 -3.5,-7.75; 7 -3,-7.75; 8 -2.5,-7.75; 9 -2,-7.75; 10 -1.5,-7.75; 11 -1,-7.75; 12 -0.5,-7.75; 13 0,-7.75; 14 0.5,-7.75; 15 1,-7.75; 16 1.5,-7.75; 17 2,-7.75; 18 2.5,-7.75; 19 3,-7.75; 20 3.5,-7.75; 21 4,-7.75; 22 4.5,-7.75; 23 5,-7.75; 24 5.5,-7.75; 25 6,-7.75; 51 6,7.75; 52 5.5,7.75; 53 5,7.75; 54 4.5,7.75; 55 4,7.75; 56 3.5,7.75; 57 3,7.75; 58 2.5,7.75; 59 2,7.75; 60 1.5,7.75; 61 1,7.75; 62 0.5,7.75; 63 0,7.75; 64 -0.5,7.75; 65 -1,7.75; 66 -1.5,7.75; 67 -2,7.75; 68 -2.5,7.75; 69 -3,7.75; 70 -3.5,7.75; 71 -4,7.75; 72 -4.5,7.75; 73 -5,7.75; 74 -5.5,7.75; 75 -6,7.75 | smd 1.2 x 0.3: 26 7.75,-6; 27 7.75,-5.5; 28 7.75,-5; 29 7.75,-4.5; 30 7.75,-4; 31 7.75,-3.5; 32 7.75,-3; 33 7.75,-2.5; 34 7.75,-2; 35 7.75,-1.5; 36 7.75,-1; 37 7.75,-0.5; 38 7.75,0; 39 7.75,0.5; 40 7.75,1; 41 7.75,1.5; 42 7.75,2; 43 7.75,2.5; 44 7.75,3; 45 7.75,3.5; 46 7.75,4; 47 7.75,4.5; 48 7.75,5; 49 7.75,5.5; 50 7.75,6; 76 -7.75,6; 77 -7.75,5.5; 78 -7.75,5; 79 -7.75,4.5; 80 -7.75,4; 81 -7.75,3.5; 82 -7.75,3; 83 -7.75,2.5; 84 -7.75,2; 85 -7.75,1.5; 86 -7.75,1; 87 -7.75,0.5; 88 -7.75,0; 89 -7.75,-0.5; 90 -7.75,-1; 91 -7.75,-1.5; 92 -7.75,-2; 93 -7.75,-2.5; 94 -7.75,-3; 95 -7.75,-3.5; 96 -7.75,-4; 97 -7.75,-4.5; 98 -7.75,-5; 99 -7.75,-5.5; 100 -7.75,-6
VSON-10-0.5MM = smd 0.6 x 0.24: 1 -1.4,1; 2 -1.4,0.5; 3 -1.4,0; 4 -1.4,-0.5; 5 -1.4,-1; 6 1.4,-1; 7 1.4,-0.5; 8 1.4,0; 9 1.4,0.5; 10 1.4,1 | smd 1.65 x 2.4: PAD 0,0
MOLEX-502382-06XX = smd 0.6 x 1.7: 1 -3.125,-5.45; 2 -1.875,-5.45; 3 -0.625,-5.45; 4 0.625,-5.45; 5 1.875,-5.45; 6 3.145,-5.45 | smd 1 x 2.8: G1 -4.975,-2.1; G2 4.975,-2.1
MOLEX-53261-0771 = smd 0.8 x 1.6: 1 -3.75,-0.8; 2 -2.5,-0.8; 3 -1.25,-0.8; 4 0,-0.8; 5 1.25,-0.8; 6 2.5,-0.8; 7 3.75,-0.8 | smd 2.1 x 3: G1 -6.3,-3.7; G2 6.3,-3.7
MOLEX-502382-03XX = smd 0.6 x 1.7: 1 -1.25,-5.45; 2 0,-5.45; 3 1.25,-5.45 | smd 1 x 2.8: G1 -3.05,-2.1; G2 3.05,-2.1
PANASONIC-SERIES-H = smd 1.7 x 3.8: 1 -2.85,0; 2 2.85,0
RESISTOR-0603 = smd 0.8 x 0.8: P$1 -0.8,0; P$2 0.8,0
KYOCERA-CX5032GA = smd 1.9 x 2.4: P$1 -2.05,0; P$2 2.05,0

### Placement (x,y rotation side)
C1  63.75,39.75 0 bottom
C2  67.75,24.25 90 bottom
C3  52.25,20.25 180 bottom
C4  52.75,39.75 0 bottom
C5  48.25,28.38 270 bottom
C6  52,29 270 top
C7  48.25,25 270 bottom
C8  43.75,25.5 180 bottom
C9  44.25,33.5 0 bottom
C12  43,6.5 180 bottom
C13  48.25,34 270 bottom
C14  47,34 270 bottom
C18  47.7,13 0 bottom
C19  47.5,8.2 180 bottom
C20  42.7,13.2 180 bottom
IC1  8,48 111.8 top
IC2  52,48 111.8 top
IC3  12,48 111.8 top
IC4  36,48 111.8 top
IC5  16,48 111.8 top
IC6  40,48 111.8 top
IC7  20,48 111.8 top
IC8  44,48 111.8 top
IC9  24,48 111.8 top
IC10  48,48 111.8 top
IC11  28,48 111.8 top
IC12  56,48 111.8 top
IC13  32,48 111.8 top
IC14  60,48 111.8 top
IC15  64,48 111.8 top
IC16  92,48 111.8 top
IC17  68,48 111.8 top
IC18  96,48 111.8 top
IC19  72,48 111.8 top
IC20  100,48 111.8 top
IC21  76,48 111.8 top
IC22  104,48 111.8 top
IC23  80,48 111.8 top
IC24  84,48 111.8 top
IC25  4,48 111.8 top
IC26  108,48 111.8 top
IC27  88,48 111.8 top
IC28  58,30 90 bottom
IC32  43.7,9.2 0 bottom
J1  61,0 180 bottom
J2  66.2,13.6 270 bottom
J3  51.25,0 180 bottom
L1  46.7,17.8 0 bottom
R1  7.5,50 180 bottom
R2  51.5,50 180 bottom
R3  8.5,47.5 180 bottom
R4  52.5,47.5 180 bottom
R5  11.5,50 180 bottom
R6  35.5,50 180 bottom
R7  12.5,47.5 180 bottom
R8  36.5,47.5 180 bottom
R9  15.5,50 180 bottom
R10  39.5,50 180 bottom
R11  16.5,47.5 180 bottom
R12  40.5,47.5 180 bottom
R13  19.5,50 180 bottom
R14  43.5,50 180 bottom
R15  20.5,47.5 180 bottom
R16  44.5,47.5 180 bottom
R17  23.5,50 180 bottom
R18  47.5,50 180 bottom
R19  24.5,47.5 180 bottom
R20  48.5,47.5 180 bottom
R21  27.5,50 180 bottom
R22  55.5,50 180 bottom
R23  28.5,47.5 180 bottom
R24  56.5,47.5 180 bottom
R25  31.5,50 180 bottom
R26  59.5,50 180 bottom
R27  32.5,47.5 180 bottom
R28  60.5,47.5 180 bottom
R29  63.5,50 180 bottom
R30  91.5,50 180 bottom
R31  64.5,47.5 180 bottom
R32  92.5,47.5 180 bottom
R33  67.5,50 180 bottom
R34  95.5,50 180 bottom
R35  68.5,47.5 180 bottom
R36  96.5,47.5 180 bottom
R37  71.5,50 180 bottom
R38  99.5,50 180 bottom
R39  72.5,47.5 180 bottom
R40  100.5,47.5 180 bottom
R41  75.5,50 180 bottom
R42  103.5,50 180 bottom
R43  76.5,47.5 180 bottom
R44  104.5,47.5 180 bottom
R45  79.5,50 180 bottom
R46  80.5,47.5 180 bottom
R47  83.5,50 180 bottom
R48  3.5,50 180 bottom
R49  84.5,47.5 180 bottom
R50  107.5,50 180 bottom
R51  87.5,50 180 bottom
R52  88.5,47.5 180 bottom
R53  55,19.5 270 bottom
R67  47.5,6.6 180 bottom
R68  41.9,15.8 270 bottom
Y1  44,29.5 90 bottom

### Tracks (layer width: path | path; a pad name or v marks a point on that pad's centre or on a via)
!RST  (via drill 0.35)  (1 unrouted)
  Top 0.2: C6.P$1 v52,30.45 52,30.5
  Bottom 0.2: IC28.14 57.6,30.5 66.3,21.8 66.3,17.3 66.95,17.3 J2.1
BOOT0
  Bottom 0.3: IC28.94 R53.P$1
GND  (via drill 0.35)
  Top 0.2: v41.25,24.5 41.25,23.38
  Bottom 0.24: C19.2 48.3,8.25 48.3,9.2 IC32.3
  Bottom 0.3: v52.75,19.25 52.75,20.21 C3.P$2 52.75,20.29 52.75,21 52.5,21.25 IC28.99 | R53.P$2 v55,17.5 | IC28.74 66.75,24.5 67,24.75 67.71,24.75 C2.P$2 67.79,24.75 v68.75,24.75 | IC28.19 IC28.20 48.29,33.5 C13.P$2 | C13.P$2 C14.P$2 v47,32.88 | C7.P$2 48.21,24.5 v47.25,24.5 | J1.1 57.9,5.43 v57.9,3.8 | J1.G1 56.12,2 v57.6,2 | J1.G2 65.88,2 v64.5,2 | J2.G2 v69.9,9.2 | J2.7 67.05,9.8 v68.7,9.8 | J2.G1 v69.9,17.9 | IC28.27 52.5,38.75 52.25,39 52.25,39.71 C4.P$2 52.25,39.79 v52.25,40.75 | IC28.49 63.5,38.75 63.25,39 63.25,39.71 C1.P$2 63.25,39.79 v63.25,40.75 | IC28.10 49.25,28.5 48.67,27.91 C5.P$2 v48.25,27.25 | C13.P$2 v48.25,32.88 | C9.2 v42.75,33.5 | C8.2 v45.25,25.5
  Bottom 0.6: J3.G2 J3.G1 | J3.3 v52.5,4
  other vias: 44.9,12.6 44.9,13.6 46.9,4 46.9,3 46.5,26.75 41.25,34.75 45.75,35 41.25,29.5 41.25,32.25 41.25,26.75
  pour Bottom (isolate 0.24, no thermals): 47.5,9.2 49.2,9.2 49.2,0.2 40.2,0.2 40.2,6.6 43.1,7.57 43.1,8.2 44.3,8.2 44.3,6.19 45.2,5.4 47.5,5.4
  pour Bottom (no thermals): 44.3,10.2 40.5,10.2 40.5,11.8 42.9,11.8 43.3,12.2 43.3,14 46.5,14 46.5,12 44.9,12 44.3,11.4
  pour Top (isolate 0.3): 40.2,0.2 54.8,0.2 54.8,13.8 49.2,13.8 46.8,13.8 46.8,11.2 42,11.2 42,13.8 40.2,13.8
  pour Top (isolate 0.3): 111.5,59.5 111.5,36.5 71.5,36.5 71.5,0.5 55.5,0.5 55.5,14.5 50,14.5 50,16 48.25,16 48.25,14.5 46.25,14.5 46.25,12 42.5,12 42.5,14.5 40.5,14.5 40.5,23.62 46.62,23.62 46.62,26 47.12,26 47.12,29.12 51.12,29.12 51.12,32.5 46.38,32.5 46.38,35.62 40.5,35.62 40.5,36.5 0.5,36.62 0.5,59.5
  pour Top: 46.12,35.38 40.5,35.38 40.5,23.88 46.38,23.88 46.38,26.25 46.88,26.25 46.88,29.38 50.88,29.38 50.88,32.25 46.12,32.25
  pour Bottom: 47.88,32.12 45.75,32.12 45.75,34.5 42,34.5 42,24.5 45.75,24.5 45.75,26.88 46.75,27.88 46.75,29.12 47,29.12 47,26.12 46.5,26.12 46.5,23.75 40.5,23.75 40.5,35.5 46.25,35.5 46.25,32.38 49,32.38 49,31
IC32_SW  (via drill 0.35)
  Route15 0.6: v49.5,15 v45.5,11
  Bottom 0.24: IC32.1 45.1,10.6 v45.5,11
  Bottom 0.6: v49.5,15 49.5,17.75 L1.1
N$1  (via drill 0.35)
  Top 0.3: v10.5,51.5 10.5,50.32 IC3.4
  Bottom 0.3: R5.P$1 10.5,50.2 v10.5,51.5
N$2  (via drill 0.35)
  Top 0.3: v6.5,51.5 6.5,50.32 IC1.4
  Bottom 0.3: R1.P$1 6.5,50.2 v6.5,51.5
N$3  (via drill 0.35)
  Top 0.3: v14.5,51.5 14.5,50.32 IC5.4
  Bottom 0.3: R9.P$1 14.5,50.2 v14.5,51.5
N$4  (via drill 0.35)
  Top 0.3: v18.5,51.5 18.5,50.32 IC7.4
  Bottom 0.3: R13.P$1 18.5,50.2 v18.5,51.5
N$5  (via drill 0.35)
  Top 0.3: v22.5,51.5 22.5,50.32 IC9.4
  Bottom 0.3: R17.P$1 22.5,50.2 v22.5,51.5
N$6  (via drill 0.35)
  Top 0.3: v26.5,51.5 26.5,50.32 IC11.4
  Bottom 0.3: R21.P$1 26.5,50.2 v26.5,51.5
N$7  (via drill 0.35)
  Top 0.3: v30.5,51.5 30.5,50.32 IC13.4
  Bottom 0.3: R25.P$1 30.5,50.2 v30.5,51.5
N$8  (via drill 0.35)
  Top 0.3: v34.5,51.5 34.5,50.32 IC4.4
  Bottom 0.3: R6.P$1 34.5,50.2 v34.5,51.5
N$9  (via drill 0.35)
  Top 0.3: v38.5,51.5 38.5,50.32 IC6.4
  Bottom 0.3: R10.P$1 38.5,50.2 v38.5,51.5
N$10  (via drill 0.35)
  Top 0.3: v42.5,51.5 42.5,50.32 IC8.4
  Bottom 0.3: R14.P$1 42.5,50.2 v42.5,51.5
N$11  (via drill 0.35)
  Top 0.3: v46.5,51.5 46.5,50.32 IC10.4
  Bottom 0.3: R18.P$1 46.5,50.2 v46.5,51.5
N$12  (via drill 0.35)
  Top 0.3: v50.5,51.5 50.5,50.32 IC2.4
  Bottom 0.3: R2.P$1 50.5,50.2 v50.5,51.5
N$13  (via drill 0.35)
  Top 0.3: v54.5,51.5 54.5,50.32 IC12.4
  Bottom 0.3: R22.P$1 54.5,50.2 v54.5,51.5
N$14  (via drill 0.35)
  Top 0.3: v58.5,51.5 58.5,50.32 IC14.4
  Bottom 0.3: R26.P$1 58.5,50.2 v58.5,51.5
N$15  (via drill 0.35)
  Top 0.3: v62.5,51.5 62.5,50.32 IC15.4
  Bottom 0.3: R29.P$1 62.5,50.2 v62.5,51.5
N$16  (via drill 0.35)
  Top 0.3: v66.5,51.5 66.5,50.32 IC17.4
  Bottom 0.3: R33.P$1 66.5,50.2 v66.5,51.5
N$17  (via drill 0.35)
  Top 0.3: v70.5,51.5 70.5,50.32 IC19.4
  Bottom 0.3: R37.P$1 70.5,50.2 v70.5,51.5
N$18  (via drill 0.35)
  Top 0.3: v74.5,51.5 74.5,50.32 IC21.4
  Bottom 0.3: R41.P$1 74.5,50.2 v74.5,51.5
N$19  (via drill 0.35)
  Top 0.3: v78.5,51.5 78.5,50.32 IC23.4
  Bottom 0.3: R45.P$1 78.5,50.2 v78.5,51.5
N$20  (via drill 0.35)
  Top 0.3: v82.5,51.5 82.5,50.32 IC24.4
  Bottom 0.3: R47.P$1 82.5,50.2 v82.5,51.5
N$21  (via drill 0.35)
  Top 0.3: v86.5,51.5 86.5,50.32 IC27.4
  Bottom 0.3: R51.P$1 86.5,50.2 v86.5,51.5
N$22  (via drill 0.35)
  Top 0.3: v90.5,51.5 90.5,50.32 IC16.4
  Bottom 0.3: R30.P$1 90.5,50.2 v90.5,51.5
N$23  (via drill 0.35)
  Top 0.3: v94.5,51.5 94.5,50.32 IC18.4
  Bottom 0.3: R34.P$1 94.5,50.2 v94.5,51.5
N$24  (via drill 0.35)
  Top 0.3: v98.5,51.5 98.5,50.32 IC20.4
  Bottom 0.3: R38.P$1 98.5,50.2 v98.5,51.5
N$25  (via drill 0.35)
  Top 0.3: v102.5,51.5 102.5,50.32 IC22.4
  Bottom 0.3: R42.P$1 102.5,50.2 v102.5,51.5
N$30  (via drill 0.35)
  Top 0.3: v106.5,51.5 106.5,50.32 IC26.4
  Bottom 0.3: R50.P$1 106.5,50.2 v106.5,51.5
N$31  (via drill 0.35)
  Top 0.3: v2.5,51.5 2.5,50.32 IC25.4
  Bottom 0.3: R48.P$1 2.5,50.2 v2.5,51.5
N$33
  Bottom 0.2: IC28.12 46.5,29.5 46.25,29.25 46.25,28.25 45.45,27.45 Y1.P$1 43.08,26.52 C8.1
N$34
  Bottom 0.2: IC28.13 49.25,30 47.7,31.55 Y1.P$2 44.92,32.48 C9.1
N$35
  Bottom 0.24: IC32.5 45.1,7.2 45.7,6.6 R67.P$1
N$40
  Bottom 0.24: IC32.4 45.6,8.7 46.1,8.2 C19.1
N$42
  Bottom 0.6: C20.1 41.83,14.93 R68.P$2
PWR_ENABLE  (via drill 0.35)
  Route15 0.24: v50,4 49.25,4 46.75,6.5 v41.25,6.5
  Bottom 0.24: IC32.7 41.45,8.7 41.25,8.5 v41.25,6.5 C12.1 | J3.1 v50,4
SENSOR_1  (via drill 0.35)
  Top 0.3: v7.75,46 8.01,46.26 IC1.1
  Route15 0.3: v54.5,31.5 54.5,34 v50,38.5
  Bottom 0.3: v54.5,31.5 54,31 IC28.15 | v50,38.5 15.25,38.5 v7.75,46 7.7,46.05 R3.P$1
SENSOR_2  (via drill 0.35)
  Top 0.3: v11.75,46 12.01,46.26 IC3.1
  Route15 0.3: v53.75,32 53.75,33.75 v48.25,39.25
  Bottom 0.3: v53.75,32 53.25,31.5 IC28.16 | v48.25,39.25 18.5,39.25 v11.75,46 11.7,46.05 R7.P$1
SENSOR_3  (via drill 0.35)
  Top 0.3: v15.75,46 16.01,46.26 IC5.1
  Route15 0.3: v53,32.5 53,33.5 v46.5,40
  Bottom 0.3: v53,32.5 52.5,32 IC28.17 | v46.5,40 21.75,40 v15.75,46 15.7,46.05 R11.P$1
SENSOR_4  (via drill 0.35)
  Top 0.3: v19.75,46 20.01,46.26 IC7.1
  Route15 0.3: v52.25,33 52.25,33.25 v44.75,40.75
  Bottom 0.3: IC28.18 51.75,32.5 v52.25,33 | v44.75,40.75 25,40.75 v19.75,46 19.7,46.05 R15.P$1
SENSOR_5  (via drill 0.35)
  Top 0.3: v23.75,46 24.01,46.26 IC9.1
  Route15 0.3: v48.5,41.5 53.5,41.5 56,39 v56,34
  Bottom 0.3: IC28.23 53.5,35 54.5,34 v56,34 | v48.5,41.5 28.25,41.5 v23.75,46 23.7,46.05 R19.P$1
SENSOR_6  (via drill 0.35)
  Top 0.3: v27.75,46 28.01,46.26 IC11.1
  Route15 0.3: v49.25,42.25 53.75,42.25 56.75,39.25 v56.75,34.75
  Bottom 0.3: v56.75,34.75 54.75,34.75 54,35.5 IC28.24 | v49.25,42.25 31.5,42.25 v27.75,46 27.7,46.05 R23.P$1
SENSOR_7  (via drill 0.35)
  Top 0.3: v31.75,46 32.01,46.26 IC13.1
  Bottom 0.3: IC28.25 51.25,36 51.5,36.25 51.5,36.75 51,37.25 51,41.75 49.75,43 34.75,43 v31.75,46 31.7,46.05 R27.P$1
SENSOR_8  (via drill 0.35)
  Top 0.3: v35.75,46 36.01,46.26 IC4.1
  Bottom 0.3: IC28.26 52,38.5 51.5,39 51.5,42.25 50.25,43.5 38.25,43.5 v35.75,46 35.7,46.05 R8.P$1
SENSOR_9  (via drill 0.35)
  Top 0.3: v39.75,46 40.01,46.26 IC6.1
  Route15 0.3: v57.5,35.5 57.5,39.5 53,44 v51,44
  Bottom 0.3: v57.5,35.5 54.75,35.5 53.5,36.75 IC28.29 | v51,44 41.75,44 v39.75,46 39.7,46.05 R12.P$1
SENSOR_10  (via drill 0.35)
  Top 0.3: v43.75,46 44.01,46.26 IC8.1
  Bottom 0.3: R16.P$1 43.7,46.05 v43.75,46 45,44.75 51.5,44.75 54,42.25 IC28.30
SENSOR_11  (via drill 0.35)
  Top 0.3: v47.75,46 48.01,46.26 IC10.1
  Bottom 0.3: IC28.31 54.5,42.75 52,45.25 48.5,45.25 v47.75,46 47.7,46.05 R20.P$1
SENSOR_12  (via drill 0.35)
  Top 0.3: v51.75,46 52.01,46.26 IC2.1
  Bottom 0.3: IC28.32 55,43.25 52.25,46 v51.75,46 51.7,46.05 R4.P$1
SENSOR_13  (via drill 0.35)
  Top 0.3: v55.5,46 56.01,46.51 IC12.1
  Bottom 0.3: IC28.33 v55.5,46 55.5,47.3 R24.P$1
SENSOR_14  (via drill 0.35)
  Top 0.3: v59.25,46 60.01,46.76 IC14.1
  Bottom 0.3: IC28.34 56,43.5 58.5,46 v59.25,46 59.7,46.45 R28.P$1
SENSOR_15  (via drill 0.35)
  Top 0.3: v63.75,46 64.01,46.26 IC15.1
  Bottom 0.3: IC28.35 56.5,43 58.75,45.25 63,45.25 v63.75,46 63.75,47.45 R31.P$1
SENSOR_16  (via drill 0.35)
  Top 0.3: v67.75,46 68.01,46.26 IC17.1
  Bottom 0.3: R35.P$1 67.75,47.45 v67.75,46 66.5,44.75 59.25,44.75 57,42.5 IC28.36
SENSOR_17  (via drill 0.35)
  Top 0.3: v71.75,46 72.01,46.26 IC19.1
  Bottom 0.3: IC28.38 58,42.5 59.75,44.25 70,44.25 v71.75,46 71.75,47.45 R39.P$1
SENSOR_18  (via drill 0.35)
  Top 0.3: v75.75,46 76.01,46.26 IC21.1
  Bottom 0.3: IC28.39 58.5,42 60.25,43.75 73.5,43.75 v75.75,46 75.75,47.45 R43.P$1
SENSOR_19  (via drill 0.35)
  Top 0.3: v79.75,46 80.01,46.26 IC23.1
  Bottom 0.3: IC28.40 59,41.5 60.75,43.25 77,43.25 v79.75,46 79.75,47.45 R46.P$1
SENSOR_20  (via drill 0.35)
  Top 0.3: v83.75,46 84.01,46.26 IC24.1
  Bottom 0.3: IC28.41 59.5,41 61.25,42.75 80.5,42.75 v83.75,46 83.75,47.45 R49.P$1
SENSOR_21  (via drill 0.35)
  Top 0.3: v87.75,46 88.01,46.26 IC27.1
  Bottom 0.3: IC28.51 66.75,36 67.5,36.75 67.5,41.25 68.5,42.25 84,42.25 v87.75,46 87.75,47.45 R52.P$1
SENSOR_22  (via drill 0.35)
  Top 0.3: v91.75,46 92.01,46.26 IC16.1
  Bottom 0.3: IC28.52 67.25,35.5 68,36.25 68,40.75 69,41.75 87.5,41.75 v91.75,46 91.75,47.45 R32.P$1
SENSOR_23  (via drill 0.35)
  Top 0.3: v95.75,46 96.01,46.26 IC18.1
  Bottom 0.3: R36.P$1 95.75,47.45 v95.75,46 91,41.25 69.5,41.25 68.5,40.25 68.5,35.75 67.75,35 IC28.53
SENSOR_24  (via drill 0.35)
  Top 0.3: v99.75,46 100.01,46.26 IC20.1
  Bottom 0.3: R40.P$1 99.75,47.45 v99.75,46 94.5,40.75 70,40.75 69,39.75 69,35.25 68.25,34.5 IC28.54
SENSOR_25  (via drill 0.35)
  Top 0.3: v103.75,46 104.01,46.26 IC22.1
  Route15 0.3: v63.75,33.5 v68.25,33.5
  Bottom 0.3: IC28.37 57.5,36.5 60.5,33.5 v63.75,33.5 | v68.25,33.5 69.5,34.75 69.5,39.25 70.5,40.25 98,40.25 v103.75,46 103.75,47.45 R44.P$1
SPI2_!SS
  Bottom 0.2: J1.6 64.14,18.35 61.5,21 IC28.81
SPI2_MISO
  Bottom 0.2: J1.4 61.62,16.88 60,18.5 IC28.84
SPI2_MOSI
  Bottom 0.2: IC28.85 59.5,17 60.38,16.12 J1.3
SPI2_SCK
  Bottom 0.2: J1.5 62.88,17.62 61,19.5 IC28.82
STLINK_SWO  (via drill 0.35)
  Route15 0.2: v65.5,12.5 v59.7,12.5
  Bottom 0.2: J2.5 66.85,12.5 v65.5,12.5 | IC28.89 57.5,14.7 v59.7,12.5
STLINK_TCK
  Bottom 0.2: J2.6 65.6,11.1 64.8,11.9 64.8,18.8 64,19.6 IC28.76
STLINK_TMS  (via drill 0.35)
  Route15 0.2: v65.5,13.75 63.75,15.5 v63.75,25.5
  Bottom 0.2: J2.4 66.85,13.75 v65.5,13.75 | IC28.72 v63.75,25.5
STLINK_USART1_RX  (via drill 0.35)
  Route15 0.2: v65.5,15 65.5,24.25 67.25,26 v67.25,26.75
  Bottom 0.2: J2.3 66.85,15 v65.5,15 | IC28.69 67,27 v67.25,26.75
STLINK_USART1_TX  (via drill 0.35)
  Route15 0.2: v69,16 69,22 70,23 70,25.75 v68.25,27.5
  Bottom 0.2: IC28.68 v68.25,27.5 | J2.2 67.1,16 v69,16
VBAT
  Bottom 0.24: IC32.2 47.2,9.7 49.25,11.75 C18.P$1
  pour Bottom (isolate 0.24, no thermals): 51.7,6 51.7,10.6 50,10.6 50,6.75 50.7,6.75 50.7,6
  pour Bottom (no thermals): 51.7,9.8 51.7,14 48.9,14 48.9,12 46.5,10.8 46.5,9.8
VDD  (via drill 0.35)
  Route2 0.6: 41.3,17 v41.9,17.6 41.9,10 v41.3,9.4
  Bottom 0.24: IC32.8 41.5,9.2 v41.3,9.4
  Bottom 0.3: v51.75,19.25 51.75,20.21 C3.P$1 51.75,20.29 51.75,21 52,21.25 IC28.100 | IC28.75 66.75,24 67,23.75 67.71,23.75 C2.P$1 67.79,23.75 v68.75,23.75 | C13.P$1 48.29,34.5 IC28.22 IC28.21 | C13.P$1 C14.P$1 v47,35.25 | IC28.6 49.29,26.5 C7.P$1 48.21,25.5 v47.25,25.5 | C13.P$1 v48.25,35.25 | IC28.28 53,38.75 53.25,39 53.25,39.71 C4.P$1 53.25,39.79 v53.25,40.75 | IC28.50 64,38.75 64.25,39 64.25,39.71 C1.P$1 64.25,39.79 v64.25,40.75 | R48.P$2 4.25,50.05 v4.25,51.5 | R50.P$2 108.5,50.2 v108.5,51.5 | IC28.11 49,29 48.83,28.84 C5.P$1 47.96,28.84 v47.5,28.38
  Bottom 0.5: R1.P$2 R3.P$2 9.25,47.45 v9.25,46 | R5.P$2 R7.P$2 13.25,47.45 v13.25,46 | R9.P$2 R11.P$2 17.25,47.45 v17.25,46 | R13.P$2 R15.P$2 21.25,47.45 v21.25,46 | R17.P$2 R19.P$2 25.25,47.45 v25.25,46 | R21.P$2 R23.P$2 29.25,47.45 v29.25,46 | R25.P$2 R27.P$2 33.25,47.45 v33.25,46 | R6.P$2 R8.P$2 37.25,47.45 v37.25,46 | R10.P$2 R12.P$2 41.25,47.45 v41.25,46 | R14.P$2 R16.P$2 45.25,47.45 v45.25,46 | R18.P$2 R20.P$2 49.25,47.45 v49.25,46 | R2.P$2 R4.P$2 53.25,47.45 v53.25,46 | R22.P$2 R24.P$2 57.25,47.45 v57.25,46 | R26.P$2 R28.P$2 61.25,47.45 v61.25,46 | R29.P$2 R31.P$2 65.25,47.45 v65.25,46 | R33.P$2 R35.P$2 69.25,47.45 v69.25,46 | R37.P$2 R39.P$2 73.25,47.45 v73.25,46 | R41.P$2 R43.P$2 77.25,47.45 v77.25,46 | R45.P$2 R46.P$2 81.25,47.45 v81.25,46 | R47.P$2 R49.P$2 85.25,47.45 v85.25,46 | R51.P$2 R52.P$2 89.25,47.45 v89.25,46 | R30.P$2 R32.P$2 93.25,47.45 v93.25,46 | R34.P$2 R36.P$2 97.25,47.45 v97.25,46 | R38.P$2 R40.P$2 101.25,47.45 v101.25,46 | R42.P$2 R44.P$2 105.25,47.45 v105.25,46
  Bottom 0.6: R68.P$1 v41.9,17.6 42.1,17.8 L1.2 43.85,19.35
  other vias: 41.9,18.8
  pour Bottom (no thermals): 43.5,16.5 40.5,16.5 40.5,19.5 43.5,19.5
  pour Route2: 111.5,59.5 111.5,36.5 71.5,36.5 71.5,16.5 40.5,16.5 40.5,23.62 46.62,23.62 46.62,26 47.12,26 47.12,29.12 51.12,29.12 51.12,32.5 46.38,32.5 46.38,35.62 40.5,35.62 40.5,36.5 0.5,36.5 0.5,59.5
WAKEUP  (via drill 0.35)
  Route15 0.2: v56.5,20.25 v56.5,24.25
  Bottom 0.2: J1.2 59.12,11.38 56.5,14 v56.5,20.25 | v56.5,24.25 54.75,26 IC28.5

### Text on the board
tNames: S1 | S25 | VAR1A REV 3.0 2019-10-06